# Altium project EASY-EAI-Nano-TB V1.01.PrjPcb (part 1 of 4)
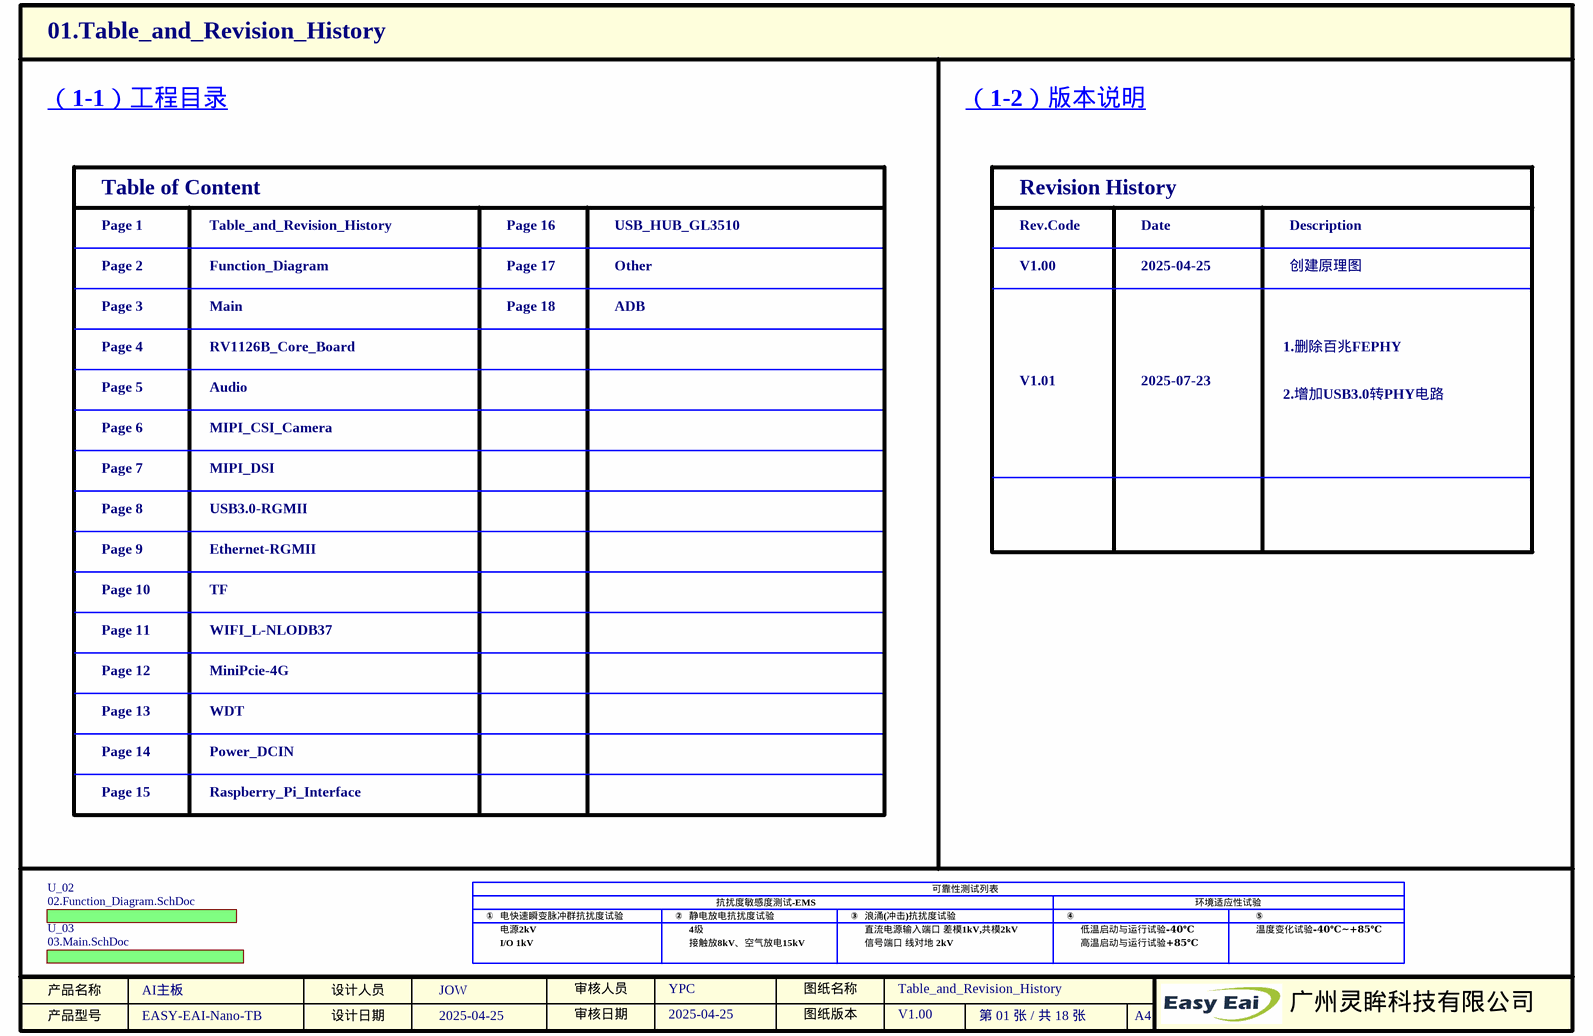
[diagram p0: 01.Table_Revision_History.SchDoc]
Designer: JOW; ProductModel: EASY-EAI-Nano-TB; ProductName: AI主板
18 sheets, 667 parts. Net scope: flat (ports and power ports of the same name join across sheets).
Board file: EASY-EAI-Nano-TB V1.01.PCBDOC
Sheets:
  01.Table_Revision_History.SchDoc
    U_02 = 02.Function_Diagram.SchDoc
    U_03 = 03.Main.SchDoc
      U_01 = 04.RV1126B_Core_Board.SchDoc
      U_14 = 14.Power_DCIN.SchDoc
      U_13 = 13.WDT.SchDoc
      U_17 = 17.Other.SchDoc
      U_05 = 05.Audio.SchDoc
      U_06 = 06.MIPI_CSI_Camera.SchDoc
      U_07 = 07.MIPI_DSI.SchDoc
      U_10 = 10.TF.SchDoc
      U_11 = 11.WIFI_L-NLODB37.SchDoc
      U_09 = 09.Ethernet-RGMII.SchDoc
      U_15 = 15.Raspberry_Pi_Interface.SchDoc
      U_08 = 08.USB3.0-RGMII.SchDoc
      U_16 = 16.USB_HUB_GL3510.SchDoc
      U_18 = 18.ADB.SchDoc
      U_12 = 12.MiniPcie-4G.SchDoc

## Sheet 01.Table_Revision_History.SchDoc
size A4; PageSetup: Record=PageOptions|CenterHorizontal=True|CenterVertical=True|PrintScale=1.00|XCorrection=1.00|YCorrection=1.00|PrintKind=0|BorderSize=5000000|LeftOffset=0|BottomOffset=0|Orientation=2|PaperLength=1000|PaperWidth=1000|Scale=100|PaperSource=7|PrintQuality=600|MediaType=1|DitherType=10|PaperKind=A4|PrintScaleMode=1; DesignDate: 2025-04-25; SheetName: Table_and_Revision_History; SheetVersion: Rev.A; SheetDescription: 工程目录及版本说明; CheckedBy: YPC; Organization: Altium Limited; Address1: L3, 12a Rodborough Rd; Address2: Frenchs Forest; Address3: NSW; Address4: Australia 2086; DocumentNumber: 1; Revision: V1.00; SheetNumber: 01; SheetTotal: 18; SheetDescribe: 工程目录及版本说明; Designer: JOW; CheckedData: 2025-04-25

### Sub-sheets
U_02 = 02.Function_Diagram.SchDoc: no entries
U_03 = 03.Main.SchDoc: no entries

### Notes on the sheet
- （1-1）工程目录
- （1-2）版本说明
- Table of Content
- Page 1
- Table_and_Revision_History
- Page 16
- USB_HUB_GL3510
- Revision History
- Rev.Code
- Date
- Description
- Page 2
- Page 3
- Function_Diagram
- Main
- Page 17
- Page 18
- Other
- ADB
- V1.00
- 2025-04-25
- 创建原理图
- Page 4
- RV1126B_Core_Board
- V1.01
- 2025-07-23
- 1.删除百兆FEPHY
- Page 5
- Page 6
- Audio
- MIPI_CSI_Camera
- 2.增加USB3.0转PHY电路
- Page 7
- Page 8
- MIPI_DSI
- USB3.0-RGMII
- Page 9
- Ethernet-RGMII
- Page 10
- Page 11
- TF
- WIFI_L-NLODB37
- Page 12
- Page 13
- MiniPcie-4G
- WDT
- Page 14
- Power_DCIN
- Page 15
- Raspberry_Pi_Interface
- ①
- 电快速瞬变脉冲群抗扰度试验
- ②
- 静电放电抗扰度试验
- 抗扰度敏感度测试-EMS
- ③
- 浪涌(冲击)抗扰度试验
- 可靠性测试列表
- ④
- 环境适应性试验
- ⑤
- 电源2kV
- I/O 1kV
- 4级
- 接触放8kV、空气放电15kV
- 直流电源输入端口 差模1kV,共模2kV
- 信号端口 线对地 2kV
- 低温启动与运行试验-40℃
- 高温启动与运行试验+85℃
- 温度变化试验-40℃~+85℃
- 产品名称
- 产品型号
- 设计人员
- 设计日期
- 审核人员
- 审核日期
- 图纸版本
- 图纸名称
- A4
- 广州灵眸科技有限公司

## Sheet 02.Function_Diagram.SchDoc
size A4; CheckedBy: YPC; DocumentNumber: 2; Revision: V1.00; SheetNumber: 02; SheetTotal: 18; SheetName: Function_Diagram; SheetDescribe: SheetDescribe; Designer: JOW; DesignDate: 2025-04-25; CheckedData: 2025-04-25; Rule: PcbType=ProtelPcb
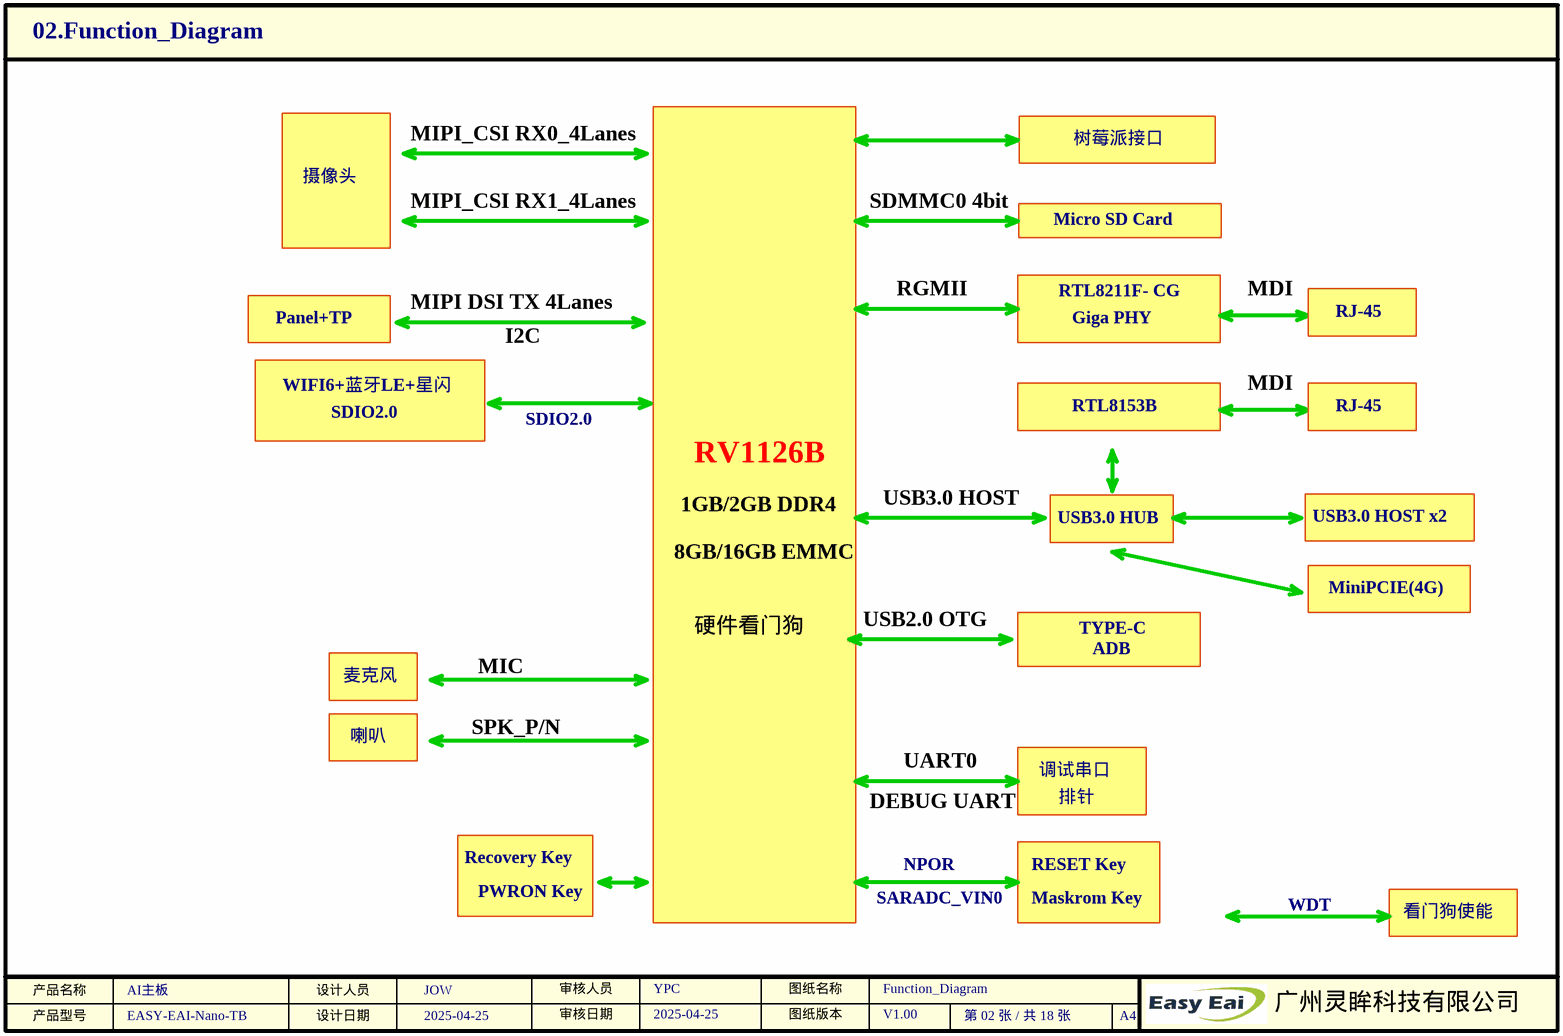
[diagram p1: 02.Function_Diagram.SchDoc]

### Notes on the sheet
- MIPI_CSI RX0_4Lanes
- 树莓派接口
- 摄像头
- MIPI_CSI RX1_4Lanes
- SDMMC0 4bit
- Micro SD Card
- MIPI DSI TX 4Lanes
- RGMII
- RTL8211F- CG
- MDI
- Panel+TP
- I2C
- Giga PHY
- RJ-45
- WIFI6+蓝牙LE+星闪
- SDIO2.0
- RTL8153B
- 1GB/2GB DDR4
- RV1126B
- USB3.0 HOST
- 8GB/16GB EMMC
- USB3.0 HUB
- USB3.0 HOST x2
- 硬件看门狗
- USB2.0 OTG
- TYPE-C
- ADB
- MiniPCIE(4G)
- 麦克风
- MIC
- 喇叭
- SPK_P/N
- UART0
- 调试串口
- DEBUG UART
- 排针
- Recovery Key
- PWRON Key
- SARADC_VIN0
- NPOR
- RESET Key
- Maskrom Key
- WDT
- 看门狗使能
- 产品名称
- 产品型号
- 设计人员
- 设计日期
- 审核人员
- 审核日期
- 图纸版本
- 图纸名称
- A4
- 广州灵眸科技有限公司

## Sheet 03.Main.SchDoc
size 566 x 398 mm; CheckedBy: YPC; DocumentNumber: 3; Revision: V1.00; SheetNumber: 03; SheetTotal: 18; SheetName: Main; SheetDescribe: Main; Designer: JOW; DesignDate: 2025-04-25; CheckedData: 2025-04-25; CheckDate: 2025-04-25
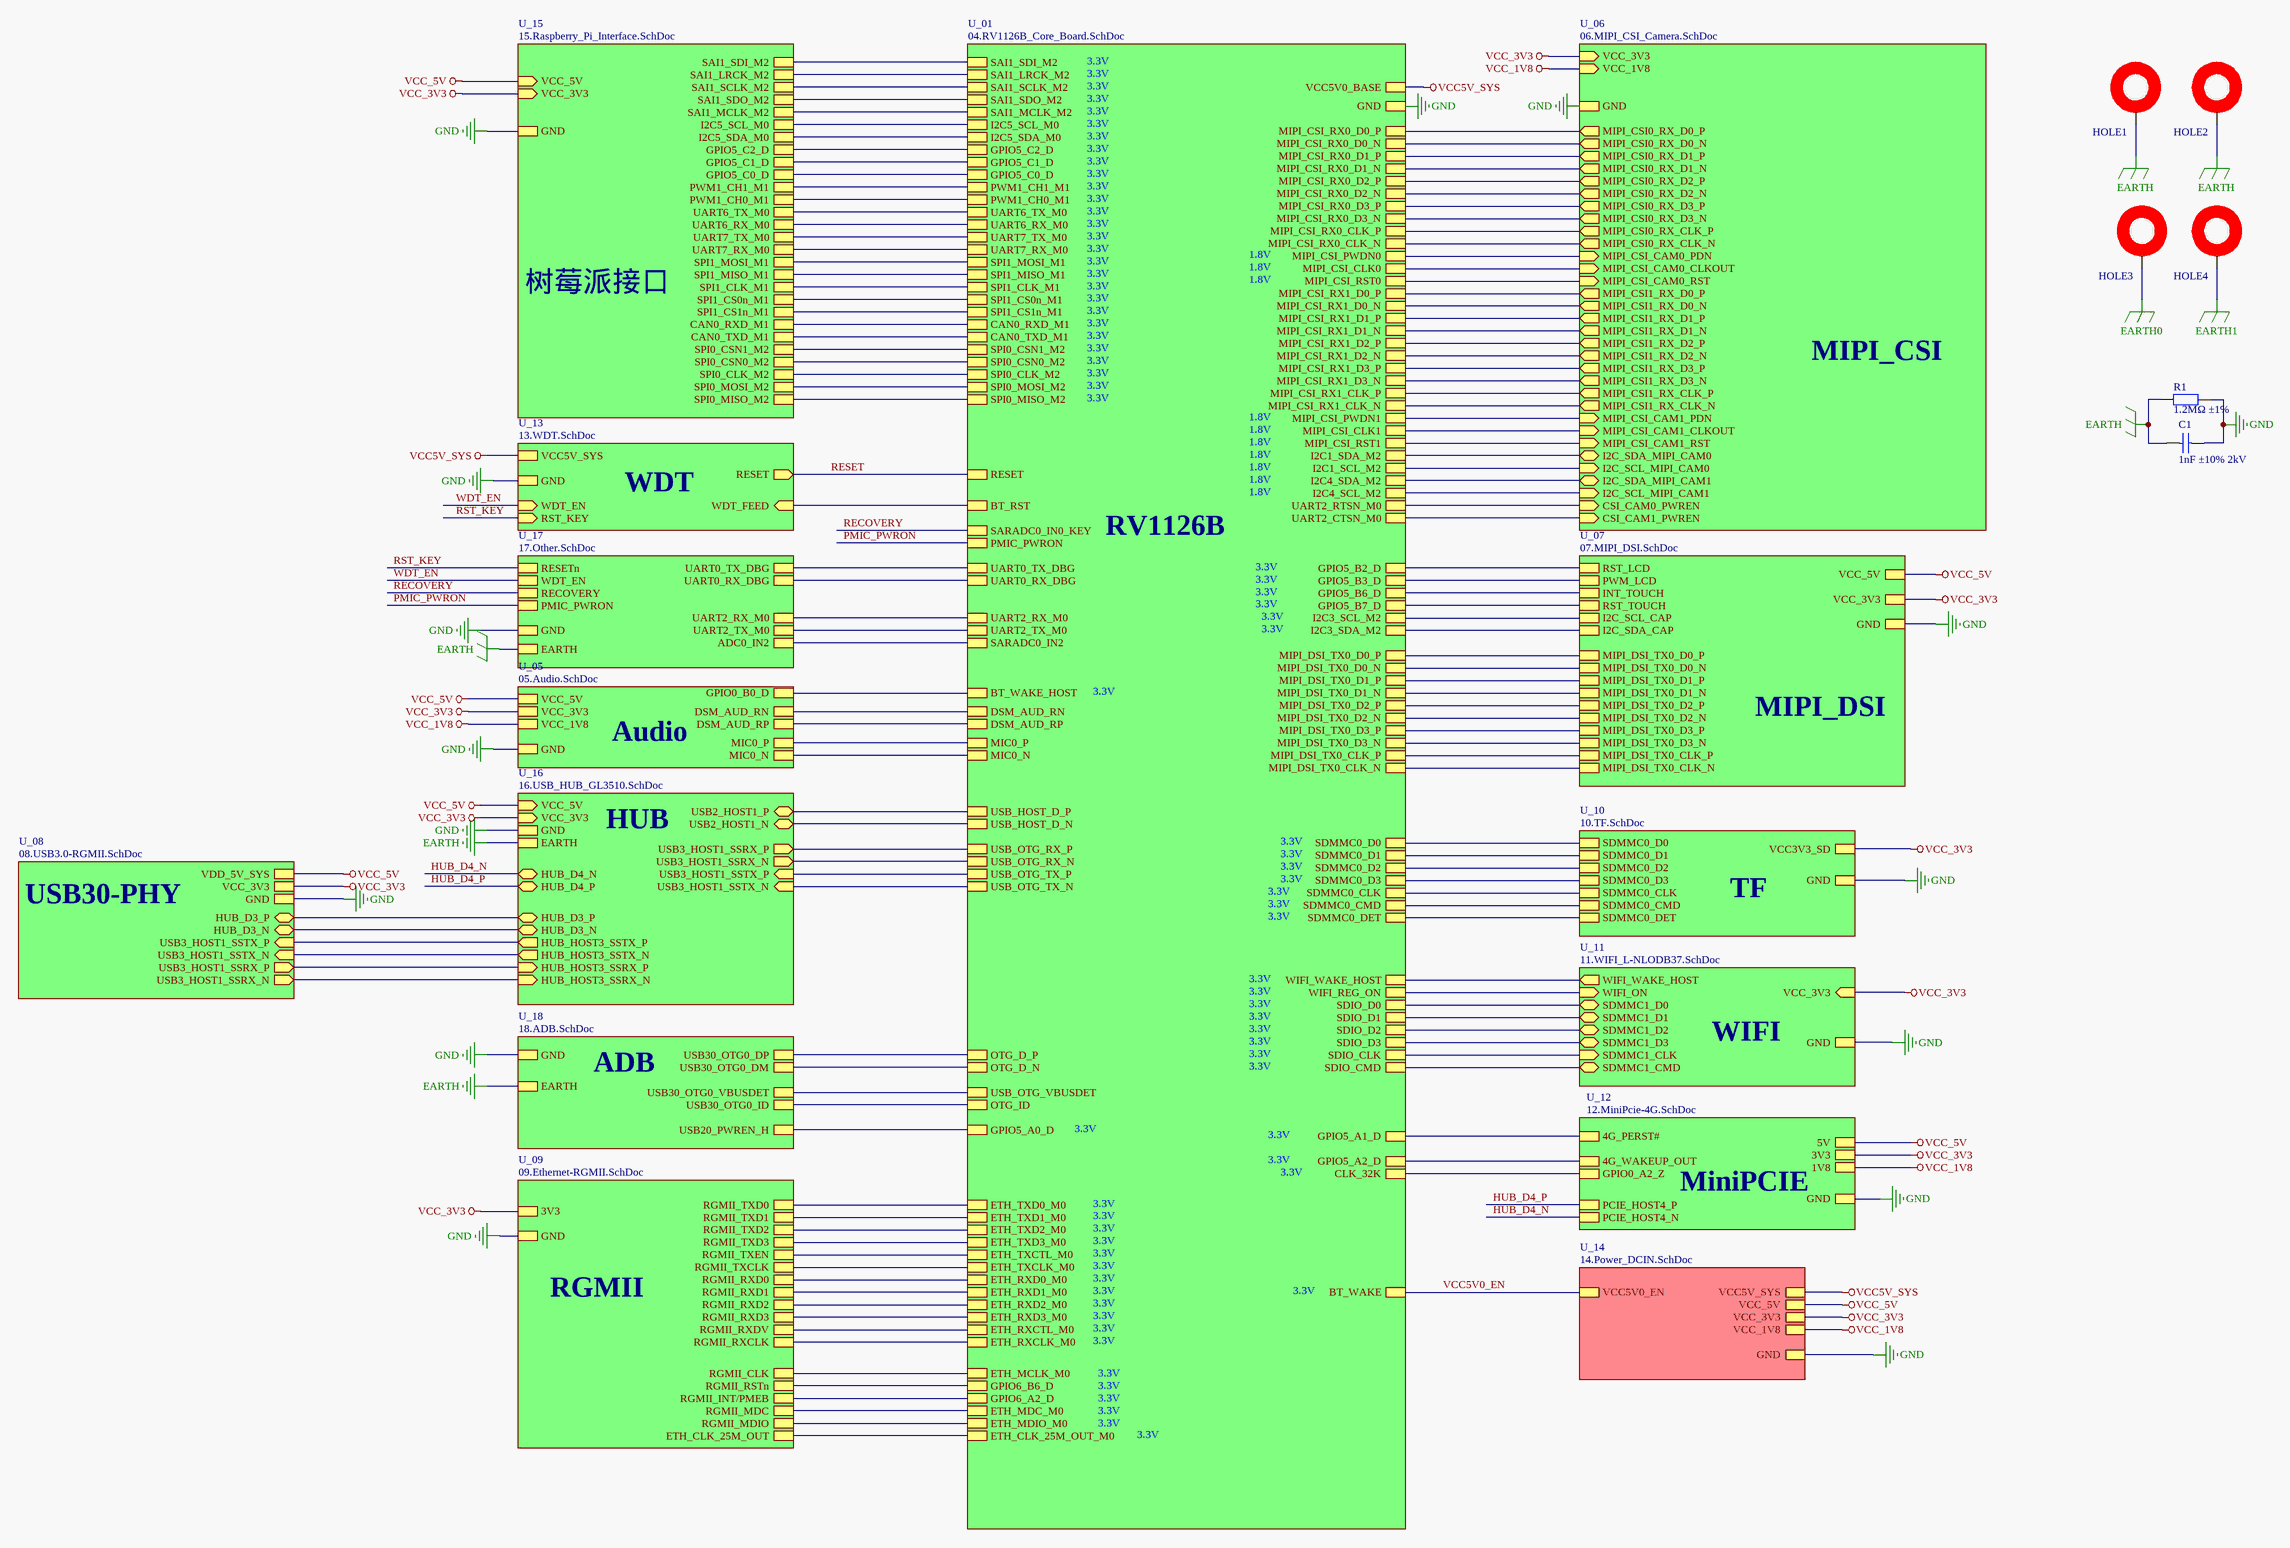
[diagram p2: 03.Main.SchDoc]

### Parts
C1  描述: 1nF ±10% 2kV  [1206_C]  (hidden comment: CC1206KKX7RDBB102)
HOLE1  HOLE1  [HOLE-3.2 - Screw]  (value not drawn)  (no BOM)
HOLE2  HOLE1  [HOLE-3.2 - Screw]  (value not drawn)  (no BOM)
HOLE3  HOLE1  [HOLE-3.2 - Screw]  (value not drawn)  (no BOM)
HOLE4  HOLE1  [HOLE-3.2 - Screw]  (value not drawn)  (no BOM)
R1  描述: 1.2MΩ ±1%  [1206_R]  (hidden comment: 1206W4F1204T5E)

### Sub-sheets
U_01 = 04.RV1126B_Core_Board.SchDoc: VCC5V0_BASE, GND, MIPI_CSI_RX1_D0_P, MIPI_CSI_RX1_D0_N, MIPI_CSI_RX1_D1_P, MIPI_CSI_RX1_D1_N, MIPI_CSI_RX1_D2_P, MIPI_CSI_RX1_D2_N, MIPI_CSI_RX1_D3_P, MIPI_CSI_RX1_D3_N, MIPI_CSI_RX1_CLK_P, MIPI_CSI_RX1_CLK_N, MIPI_CSI_PWDN1, MIPI_CSI_CLK1, MIPI_CSI_RST1, MIPI_CSI_RX0_D0_P, MIPI_CSI_RX0_D0_N, MIPI_CSI_RX0_D1_P, MIPI_CSI_RX0_D1_N, MIPI_CSI_RX0_D2_P, MIPI_CSI_RX0_D2_N, MIPI_CSI_RX0_D3_P, MIPI_CSI_RX0_D3_N, MIPI_CSI_RX0_CLK_P, MIPI_CSI_RX0_CLK_N, MIPI_CSI_PWDN0, MIPI_CSI_CLK0, MIPI_CSI_RST0, OTG_ID, OTG_D_N, OTG_D_P, USB_HOST_D_N, USB_HOST_D_P, MIPI_DSI_TX0_D0_P, MIPI_DSI_TX0_D0_N, MIPI_DSI_TX0_D1_P, MIPI_DSI_TX0_D1_N, MIPI_DSI_TX0_D2_P, MIPI_DSI_TX0_D2_N, MIPI_DSI_TX0_D3_P, MIPI_DSI_TX0_D3_N, MIPI_DSI_TX0_CLK_P, MIPI_DSI_TX0_CLK_N, SDMMC0_CMD, SDMMC0_D0, SDMMC0_D1, SDMMC0_D2, SDMMC0_D3, SDMMC0_CLK, CLK_32K, BT_WAKE, SDIO_CLK, SDIO_D0, SDIO_D1, SDIO_D2, SDIO_D3, SDIO_CMD, RESET, SDMMC0_DET, WIFI_REG_ON, BT_RST, WIFI_WAKE_HOST, SPI0_MOSI_M2, SPI0_CLK_M2, UART7_TX_M0, SPI0_CSN0_M2, UART6_RX_M0, UART6_TX_M0, GPIO5_B3_D, GPIO5_B2_D, GPIO5_A1_D, GPIO5_A0_D, SPI0_CSN1_M2, GPIO5_A2_D, DSM_AUD_RP, MIC0_P, MIC0_N, USB_OTG_VBUSDET, GPIO5_C2_D, SPI0_MISO_M2, I2C3_SCL_M2, I2C3_SDA_M2, PWM1_CH1_M1, PWM1_CH0_M1, SAI1_SDI_M2, SAI1_LRCK_M2, SAI1_SCLK_M2, SAI1_SDO_M2, SAI1_MCLK_M2, GPIO5_C1_D, GPIO5_C0_D, UART7_RX_M0, GPIO5_B6_D, GPIO5_B7_D, ETH_RXCLK_M0, ETH_MCLK_M0, ETH_TXCTL_M0, ETH_RXD0_M0, ETH_TXD1_M0, ETH_TXD0_M0, ETH_TXD3_M0, ETH_RXD2_M0, ETH_TXD2_M0, ETH_RXD1_M0, ETH_RXD3_M0, GPIO6_A2_D, CAN0_TXD_M1, ETH_RXCTL_M0, GPIO6_B6_D, ETH_MDIO_M0, ETH_CLK_25M_OUT_M0, ETH_MDC_M0, ETH_TXCLK_M0, CAN0_RXD_M1, UART0_RX_DBG, UART0_TX_DBG, UART2_RX_M0, UART2_TX_M0, UART2_RTSN_M0, UART2_CTSN_M0, SARADC0_IN2, SARADC0_IN0_KEY, PMIC_PWRON, USB_OTG_TX_P, USB_OTG_TX_N, USB_OTG_RX_P, USB_OTG_RX_N, I2C1_SDA_M2, I2C1_SCL_M2, I2C5_SDA_M0, I2C4_SDA_M2, I2C4_SCL_M2, I2C5_SCL_M0, SPI1_MOSI_M1, SPI1_MISO_M1, SPI1_CS1n_M1, SPI1_CLK_M1, SPI1_CS0n_M1, DSM_AUD_RN, BT_WAKE_HOST
U_05 = 05.Audio.SchDoc: GND, DSM_AUD_RN, DSM_AUD_RP, MIC0_P, MIC0_N, VCC_1V8, VCC_5V, GPIO0_B0_D, VCC_3V3
U_06 = 06.MIPI_CSI_Camera.SchDoc: MIPI_CSI1_RX_CLK_N (out), MIPI_CSI1_RX_CLK_P (out), MIPI_CSI1_RX_D0_N (out), MIPI_CSI1_RX_D0_P (out), MIPI_CSI1_RX_D1_N (out), MIPI_CSI1_RX_D1_P (out), MIPI_CSI1_RX_D2_N (out), MIPI_CSI1_RX_D2_P (out), MIPI_CSI1_RX_D3_N (out), MIPI_CSI1_RX_D3_P (out), MIPI_CSI0_RX_D2_N (out), MIPI_CSI0_RX_D3_N (out), MIPI_CSI0_RX_D2_P (out), MIPI_CSI0_RX_D3_P (out), MIPI_CSI0_RX_D1_N (out), MIPI_CSI0_RX_D1_P (out), MIPI_CSI0_RX_CLK_N (out), MIPI_CSI0_RX_CLK_P (out), MIPI_CSI0_RX_D0_N (out), MIPI_CSI0_RX_D0_P (out), I2C_SDA_MIPI_CAM0 (bidir), I2C_SCL_MIPI_CAM0 (in), I2C_SDA_MIPI_CAM1 (bidir), I2C_SCL_MIPI_CAM1 (in), GND, VCC_3V3 (in), VCC_1V8 (in), MIPI_CSI_CAM0_RST (in), MIPI_CSI_CAM0_PDN (in), MIPI_CSI_CAM0_CLKOUT (in), MIPI_CSI_CAM1_RST (in), MIPI_CSI_CAM1_PDN (in), MIPI_CSI_CAM1_CLKOUT (in), CSI_CAM1_PWREN (in), CSI_CAM0_PWREN (in)
U_07 = 07.MIPI_DSI.SchDoc: GND, RST_LCD, PWM_LCD, I2C_SDA_CAP, I2C_SCL_CAP, INT_TOUCH, RST_TOUCH, VCC_3V3, MIPI_DSI_TX0_D0_P, MIPI_DSI_TX0_D0_N, MIPI_DSI_TX0_D1_P, MIPI_DSI_TX0_D1_N, MIPI_DSI_TX0_D2_P, MIPI_DSI_TX0_D2_N, MIPI_DSI_TX0_D3_P, MIPI_DSI_TX0_D3_N, MIPI_DSI_TX0_CLK_P, MIPI_DSI_TX0_CLK_N, VCC_5V
U_08 = 08.USB3.0-RGMII.SchDoc: USB3_HOST1_SSRX_N (out), USB3_HOST1_SSTX_P (in), USB3_HOST1_SSTX_N (in), GND, VDD_5V_SYS, HUB_D3_N (bidir), USB3_HOST1_SSRX_P (out), HUB_D3_P (bidir), VCC_3V3
U_09 = 09.Ethernet-RGMII.SchDoc: GND, 3V3, RGMII_TXD0, RGMII_TXD1, RGMII_TXD2, RGMII_TXD3, RGMII_TXEN, RGMII_TXCLK, RGMII_RXD0, RGMII_RXD1, RGMII_RXD2, RGMII_RXD3, RGMII_RXDV, RGMII_RXCLK, ETH_CLK_25M_OUT, RGMII_CLK, RGMII_MDC, RGMII_MDIO, RGMII_RSTn, RGMII_INT/PMEB
U_10 = 10.TF.SchDoc: SDMMC0_D0, SDMMC0_D1, SDMMC0_D2, SDMMC0_D3, SDMMC0_CLK, SDMMC0_CMD, SDMMC0_DET, VCC3V3_SD, GND
U_11 = 11.WIFI_L-NLODB37.SchDoc: GND, VCC_3V3 (in), SDMMC1_D3 (bidir), SDMMC1_D2 (bidir), SDMMC1_D1 (bidir), SDMMC1_D0 (bidir), SDMMC1_CMD (bidir), SDMMC1_CLK (in), WIFI_ON (in), WIFI_WAKE_HOST (out)
U_12 = 12.MiniPcie-4G.SchDoc: GND, 5V, 3V3, 4G_PERST#, 4G_WAKEUP_OUT, 1V8, PCIE_HOST4_P, PCIE_HOST4_N, GPIO0_A2_Z
U_13 = 13.WDT.SchDoc: WDT_FEED (in), WDT_EN (in), RESET (out), RST_KEY (in), GND, VCC5V_SYS
U_14 = 14.Power_DCIN.SchDoc: GND, VCC_3V3, VCC_1V8, VCC_5V, VCC5V0_EN, VCC5V_SYS
U_15 = 15.Raspberry_Pi_Interface.SchDoc: VCC_5V (in), VCC_3V3 (in), GND, SAI1_SDI_M2, SAI1_LRCK_M2, SAI1_SCLK_M2, SAI1_SDO_M2, SAI1_MCLK_M2, SPI1_CS1n_M1, SPI1_CS0n_M1, SPI1_CLK_M1, SPI1_MISO_M1, SPI1_MOSI_M1, PWM1_CH1_M1, PWM1_CH0_M1, GPIO5_C2_D, GPIO5_C1_D, GPIO5_C0_D, SPI0_CSN1_M2, SPI0_CSN0_M2, SPI0_CLK_M2, SPI0_MOSI_M2, I2C5_SCL_M0, I2C5_SDA_M0, SPI0_MISO_M2, UART6_TX_M0, UART6_RX_M0, UART7_TX_M0, UART7_RX_M0, CAN0_RXD_M1, CAN0_TXD_M1
U_16 = 16.USB_HUB_GL3510.SchDoc: GND, VCC_5V (in), VCC_3V3 (in), USB2_HOST1_P (bidir), USB2_HOST1_N (bidir), USB3_HOST1_SSRX_P (out), USB3_HOST1_SSRX_N (out), USB3_HOST1_SSTX_P (in), USB3_HOST1_SSTX_N (in), EARTH, HUB_D4_P (bidir), HUB_D4_N (bidir), HUB_HOST3_SSRX_N (in), HUB_HOST3_SSRX_P (in), HUB_D3_N (bidir), HUB_HOST3_SSTX_N (out), HUB_HOST3_SSTX_P (out), HUB_D3_P (bidir)
U_17 = 17.Other.SchDoc: RESETn, PMIC_PWRON, RECOVERY, UART0_RX_DBG, UART0_TX_DBG, WDT_EN, UART2_RX_M0, UART2_TX_M0, ADC0_IN2, GND, EARTH
U_18 = 18.ADB.SchDoc: GND, EARTH, USB30_OTG0_VBUSDET, USB30_OTG0_DP, USB30_OTG0_DM, USB30_OTG0_ID, USB20_PWREN_H

### Nets
EARTH: C1.1 HOLE1.1 HOLE2.1 R1.1 ; sheet U_17/EARTH, sheet U_16/EARTH, sheet U_18/EARTH
EARTH0: HOLE3.1
EARTH1: HOLE4.1
GND: C1.2 R1.2 ; sheet U_01/GND, sheet U_14/GND, sheet U_13/GND, sheet U_17/GND, sheet U_05/GND, sheet U_06/GND, sheet U_07/GND, sheet U_10/GND, sheet U_11/GND, sheet U_09/GND, sheet U_15/GND, sheet U_08/GND, sheet U_16/GND, sheet U_18/GND, sheet U_12/GND  [project net CHIP_GND]
VCC5V_SYS: sheet U_01/VCC5V0_BASE, sheet U_14/VCC5V_SYS, sheet U_13/VCC5V_SYS
VCC_1V8: sheet U_14/VCC_1V8, sheet U_05/VCC_1V8, sheet U_06/VCC_1V8, sheet U_12/1V8
VCC_3V3: sheet U_14/VCC_3V3, sheet U_05/VCC_3V3, sheet U_06/VCC_3V3, sheet U_07/VCC_3V3, sheet U_10/VCC3V3_SD, sheet U_11/VCC_3V3, sheet U_09/3V3, sheet U_15/VCC_3V3, sheet U_08/VCC_3V3, sheet U_16/VCC_3V3, sheet U_12/3V3  [project net VCC3V3]
VCC_5V: sheet U_14/VCC_5V, sheet U_05/VCC_5V, sheet U_07/VCC_5V, sheet U_15/VCC_5V, sheet U_08/VDD_5V_SYS, sheet U_16/VCC_5V, sheet U_12/5V
HUB_D4_N: sheet U_16/HUB_D4_N, sheet U_12/PCIE_HOST4_N
HUB_D4_P: sheet U_16/HUB_D4_P, sheet U_12/PCIE_HOST4_P
PMIC_PWRON: sheet U_01/PMIC_PWRON, sheet U_17/PMIC_PWRON
RECOVERY: sheet U_01/SARADC0_IN0_KEY, sheet U_17/RECOVERY
RESET: sheet U_01/RESET, sheet U_13/RESET
RST_KEY: sheet U_13/RST_KEY, sheet U_17/RESETn
VCC5V0_EN: sheet U_01/BT_WAKE, sheet U_14/VCC5V0_EN
WDT_EN: sheet U_13/WDT_EN, sheet U_17/WDT_EN
(unnamed): sheet U_01/MIPI_CSI_RX1_D0_P, sheet U_06/MIPI_CSI1_RX_D0_P
(unnamed): sheet U_01/MIPI_CSI_RX1_D0_N, sheet U_06/MIPI_CSI1_RX_D0_N
(unnamed): sheet U_01/MIPI_CSI_RX1_D1_P, sheet U_06/MIPI_CSI1_RX_D1_P
(unnamed): sheet U_01/MIPI_CSI_RX1_D1_N, sheet U_06/MIPI_CSI1_RX_D1_N
(unnamed): sheet U_01/MIPI_CSI_RX1_D2_P, sheet U_06/MIPI_CSI1_RX_D2_P
(unnamed): sheet U_01/MIPI_CSI_RX1_D2_N, sheet U_06/MIPI_CSI1_RX_D2_N
(unnamed): sheet U_01/MIPI_CSI_RX1_D3_P, sheet U_06/MIPI_CSI1_RX_D3_P
(unnamed): sheet U_01/MIPI_CSI_RX1_D3_N, sheet U_06/MIPI_CSI1_RX_D3_N
(unnamed): sheet U_01/MIPI_CSI_RX1_CLK_P, sheet U_06/MIPI_CSI1_RX_CLK_P
(unnamed): sheet U_01/MIPI_CSI_RX1_CLK_N, sheet U_06/MIPI_CSI1_RX_CLK_N
(unnamed): sheet U_01/MIPI_CSI_PWDN1, sheet U_06/MIPI_CSI_CAM1_PDN
(unnamed): sheet U_01/MIPI_CSI_CLK1, sheet U_06/MIPI_CSI_CAM1_CLKOUT
(unnamed): sheet U_01/MIPI_CSI_RST1, sheet U_06/MIPI_CSI_CAM1_RST
(unnamed): sheet U_01/MIPI_CSI_RX0_D0_P, sheet U_06/MIPI_CSI0_RX_D0_P
(unnamed): sheet U_01/MIPI_CSI_RX0_D0_N, sheet U_06/MIPI_CSI0_RX_D0_N
(unnamed): sheet U_01/MIPI_CSI_RX0_D1_P, sheet U_06/MIPI_CSI0_RX_D1_P
(unnamed): sheet U_01/MIPI_CSI_RX0_D1_N, sheet U_06/MIPI_CSI0_RX_D1_N
(unnamed): sheet U_01/MIPI_CSI_RX0_D2_P, sheet U_06/MIPI_CSI0_RX_D2_P
(unnamed): sheet U_01/MIPI_CSI_RX0_D2_N, sheet U_06/MIPI_CSI0_RX_D2_N
(unnamed): sheet U_01/MIPI_CSI_RX0_D3_P, sheet U_06/MIPI_CSI0_RX_D3_P
(unnamed): sheet U_01/MIPI_CSI_RX0_D3_N, sheet U_06/MIPI_CSI0_RX_D3_N
(unnamed): sheet U_01/MIPI_CSI_RX0_CLK_P, sheet U_06/MIPI_CSI0_RX_CLK_P
(unnamed): sheet U_01/MIPI_CSI_RX0_CLK_N, sheet U_06/MIPI_CSI0_RX_CLK_N
(unnamed): sheet U_01/MIPI_CSI_PWDN0, sheet U_06/MIPI_CSI_CAM0_PDN
(unnamed): sheet U_01/MIPI_CSI_CLK0, sheet U_06/MIPI_CSI_CAM0_CLKOUT
(unnamed): sheet U_01/MIPI_CSI_RST0, sheet U_06/MIPI_CSI_CAM0_RST
(unnamed): sheet U_01/OTG_ID, sheet U_18/USB30_OTG0_ID
(unnamed): sheet U_01/OTG_D_N, sheet U_18/USB30_OTG0_DM
(unnamed): sheet U_01/OTG_D_P, sheet U_18/USB30_OTG0_DP
(unnamed): sheet U_01/USB_HOST_D_N, sheet U_16/USB2_HOST1_N
(unnamed): sheet U_01/USB_HOST_D_P, sheet U_16/USB2_HOST1_P
(unnamed): sheet U_01/MIPI_DSI_TX0_D0_P, sheet U_07/MIPI_DSI_TX0_D0_P
(unnamed): sheet U_01/MIPI_DSI_TX0_D0_N, sheet U_07/MIPI_DSI_TX0_D0_N
(unnamed): sheet U_01/MIPI_DSI_TX0_D1_P, sheet U_07/MIPI_DSI_TX0_D1_P
(unnamed): sheet U_01/MIPI_DSI_TX0_D1_N, sheet U_07/MIPI_DSI_TX0_D1_N
(unnamed): sheet U_01/MIPI_DSI_TX0_D2_P, sheet U_07/MIPI_DSI_TX0_D2_P
(unnamed): sheet U_01/MIPI_DSI_TX0_D2_N, sheet U_07/MIPI_DSI_TX0_D2_N
(unnamed): sheet U_01/MIPI_DSI_TX0_D3_P, sheet U_07/MIPI_DSI_TX0_D3_P
(unnamed): sheet U_01/MIPI_DSI_TX0_D3_N, sheet U_07/MIPI_DSI_TX0_D3_N
(unnamed): sheet U_01/MIPI_DSI_TX0_CLK_P, sheet U_07/MIPI_DSI_TX0_CLK_P
(unnamed): sheet U_01/MIPI_DSI_TX0_CLK_N, sheet U_07/MIPI_DSI_TX0_CLK_N
(unnamed): sheet U_01/SDMMC0_CMD, sheet U_10/SDMMC0_CMD
(unnamed): sheet U_01/SDMMC0_D0, sheet U_10/SDMMC0_D0
(unnamed): sheet U_01/SDMMC0_D1, sheet U_10/SDMMC0_D1
(unnamed): sheet U_01/SDMMC0_D2, sheet U_10/SDMMC0_D2
(unnamed): sheet U_01/SDMMC0_D3, sheet U_10/SDMMC0_D3
(unnamed): sheet U_01/SDMMC0_CLK, sheet U_10/SDMMC0_CLK
(unnamed): sheet U_01/CLK_32K, sheet U_12/GPIO0_A2_Z
(unnamed): sheet U_01/SDIO_CLK, sheet U_11/SDMMC1_CLK
(unnamed): sheet U_01/SDIO_D0, sheet U_11/SDMMC1_D0
(unnamed): sheet U_01/SDIO_D1, sheet U_11/SDMMC1_D1
(unnamed): sheet U_01/SDIO_D2, sheet U_11/SDMMC1_D2
(unnamed): sheet U_01/SDIO_D3, sheet U_11/SDMMC1_D3
(unnamed): sheet U_01/SDIO_CMD, sheet U_11/SDMMC1_CMD
(unnamed): sheet U_01/SDMMC0_DET, sheet U_10/SDMMC0_DET
(unnamed): sheet U_01/WIFI_REG_ON, sheet U_11/WIFI_ON
(unnamed): sheet U_01/BT_RST, sheet U_13/WDT_FEED
(unnamed): sheet U_01/WIFI_WAKE_HOST, sheet U_11/WIFI_WAKE_HOST
(unnamed): sheet U_01/SPI0_MOSI_M2, sheet U_15/SPI0_MOSI_M2
(unnamed): sheet U_01/SPI0_CLK_M2, sheet U_15/SPI0_CLK_M2
(unnamed): sheet U_01/UART7_TX_M0, sheet U_15/UART7_TX_M0
(unnamed): sheet U_01/SPI0_CSN0_M2, sheet U_15/SPI0_CSN0_M2
(unnamed): sheet U_01/UART6_RX_M0, sheet U_15/UART6_RX_M0
(unnamed): sheet U_01/UART6_TX_M0, sheet U_15/UART6_TX_M0
(unnamed): sheet U_01/GPIO5_B3_D, sheet U_07/PWM_LCD
(unnamed): sheet U_01/GPIO5_B2_D, sheet U_07/RST_LCD
(unnamed): sheet U_01/GPIO5_A1_D, sheet U_12/4G_PERST#
(unnamed): sheet U_01/GPIO5_A0_D, sheet U_18/USB20_PWREN_H
(unnamed): sheet U_01/SPI0_CSN1_M2, sheet U_15/SPI0_CSN1_M2
(unnamed): sheet U_01/GPIO5_A2_D, sheet U_12/4G_WAKEUP_OUT
(unnamed): sheet U_01/DSM_AUD_RP, sheet U_05/DSM_AUD_RP
(unnamed): sheet U_01/MIC0_P, sheet U_05/MIC0_P
(unnamed): sheet U_01/MIC0_N, sheet U_05/MIC0_N
(unnamed): sheet U_01/USB_OTG_VBUSDET, sheet U_18/USB30_OTG0_VBUSDET
(unnamed): sheet U_01/GPIO5_C2_D, sheet U_15/GPIO5_C2_D
(unnamed): sheet U_01/SPI0_MISO_M2, sheet U_15/SPI0_MISO_M2
(unnamed): sheet U_01/I2C3_SCL_M2, sheet U_07/I2C_SCL_CAP
(unnamed): sheet U_01/I2C3_SDA_M2, sheet U_07/I2C_SDA_CAP
(unnamed): sheet U_01/PWM1_CH1_M1, sheet U_15/PWM1_CH1_M1
(unnamed): sheet U_01/PWM1_CH0_M1, sheet U_15/PWM1_CH0_M1
(unnamed): sheet U_01/SAI1_SDI_M2, sheet U_15/SAI1_SDI_M2
(unnamed): sheet U_01/SAI1_LRCK_M2, sheet U_15/SAI1_LRCK_M2
(unnamed): sheet U_01/SAI1_SCLK_M2, sheet U_15/SAI1_SCLK_M2
(unnamed): sheet U_01/SAI1_SDO_M2, sheet U_15/SAI1_SDO_M2
(unnamed): sheet U_01/SAI1_MCLK_M2, sheet U_15/SAI1_MCLK_M2
(unnamed): sheet U_01/GPIO5_C1_D, sheet U_15/GPIO5_C1_D
(unnamed): sheet U_01/GPIO5_C0_D, sheet U_15/GPIO5_C0_D
(unnamed): sheet U_01/UART7_RX_M0, sheet U_15/UART7_RX_M0
(unnamed): sheet U_01/GPIO5_B6_D, sheet U_07/INT_TOUCH
(unnamed): sheet U_01/GPIO5_B7_D, sheet U_07/RST_TOUCH
(unnamed): sheet U_01/ETH_RXCLK_M0, sheet U_09/RGMII_RXCLK
(unnamed): sheet U_01/ETH_MCLK_M0, sheet U_09/RGMII_CLK
(unnamed): sheet U_01/ETH_TXCTL_M0, sheet U_09/RGMII_TXEN
(unnamed): sheet U_01/ETH_RXD0_M0, sheet U_09/RGMII_RXD0
(unnamed): sheet U_01/ETH_TXD1_M0, sheet U_09/RGMII_TXD1
(unnamed): sheet U_01/ETH_TXD0_M0, sheet U_09/RGMII_TXD0
(unnamed): sheet U_01/ETH_TXD3_M0, sheet U_09/RGMII_TXD3
(unnamed): sheet U_01/ETH_RXD2_M0, sheet U_09/RGMII_RXD2
(unnamed): sheet U_01/ETH_TXD2_M0, sheet U_09/RGMII_TXD2
(unnamed): sheet U_01/ETH_RXD1_M0, sheet U_09/RGMII_RXD1
(unnamed): sheet U_01/ETH_RXD3_M0, sheet U_09/RGMII_RXD3
(unnamed): sheet U_01/GPIO6_A2_D, sheet U_09/RGMII_INT/PMEB
(unnamed): sheet U_01/CAN0_TXD_M1, sheet U_15/CAN0_TXD_M1
(unnamed): sheet U_01/ETH_RXCTL_M0, sheet U_09/RGMII_RXDV
(unnamed): sheet U_01/GPIO6_B6_D, sheet U_09/RGMII_RSTn
(unnamed): sheet U_01/ETH_MDIO_M0, sheet U_09/RGMII_MDIO
(unnamed): sheet U_01/ETH_CLK_25M_OUT_M0, sheet U_09/ETH_CLK_25M_OUT
(unnamed): sheet U_01/ETH_MDC_M0, sheet U_09/RGMII_MDC
(unnamed): sheet U_01/ETH_TXCLK_M0, sheet U_09/RGMII_TXCLK
(unnamed): sheet U_01/CAN0_RXD_M1, sheet U_15/CAN0_RXD_M1
(unnamed): sheet U_01/UART0_RX_DBG, sheet U_17/UART0_RX_DBG
(unnamed): sheet U_01/UART0_TX_DBG, sheet U_17/UART0_TX_DBG
(unnamed): sheet U_01/UART2_RX_M0, sheet U_17/UART2_RX_M0
(unnamed): sheet U_01/UART2_TX_M0, sheet U_17/UART2_TX_M0
(unnamed): sheet U_01/UART2_RTSN_M0, sheet U_06/CSI_CAM0_PWREN
(unnamed): sheet U_01/UART2_CTSN_M0, sheet U_06/CSI_CAM1_PWREN
(unnamed): sheet U_01/SARADC0_IN2, sheet U_17/ADC0_IN2
(unnamed): sheet U_01/USB_OTG_TX_P, sheet U_16/USB3_HOST1_SSTX_P
(unnamed): sheet U_01/USB_OTG_TX_N, sheet U_16/USB3_HOST1_SSTX_N
(unnamed): sheet U_01/USB_OTG_RX_P, sheet U_16/USB3_HOST1_SSRX_P
(unnamed): sheet U_01/USB_OTG_RX_N, sheet U_16/USB3_HOST1_SSRX_N
(unnamed): sheet U_01/I2C1_SDA_M2, sheet U_06/I2C_SDA_MIPI_CAM0
(unnamed): sheet U_01/I2C1_SCL_M2, sheet U_06/I2C_SCL_MIPI_CAM0
(unnamed): sheet U_01/I2C5_SDA_M0, sheet U_15/I2C5_SDA_M0
(unnamed): sheet U_01/I2C4_SDA_M2, sheet U_06/I2C_SDA_MIPI_CAM1
(unnamed): sheet U_01/I2C4_SCL_M2, sheet U_06/I2C_SCL_MIPI_CAM1
(unnamed): sheet U_01/I2C5_SCL_M0, sheet U_15/I2C5_SCL_M0
(unnamed): sheet U_01/SPI1_MOSI_M1, sheet U_15/SPI1_MOSI_M1
(unnamed): sheet U_01/SPI1_MISO_M1, sheet U_15/SPI1_MISO_M1
(unnamed): sheet U_01/SPI1_CS1n_M1, sheet U_15/SPI1_CS1n_M1
(unnamed): sheet U_01/SPI1_CLK_M1, sheet U_15/SPI1_CLK_M1
(unnamed): sheet U_01/SPI1_CS0n_M1, sheet U_15/SPI1_CS0n_M1
(unnamed): sheet U_01/DSM_AUD_RN, sheet U_05/DSM_AUD_RN
(unnamed): sheet U_01/BT_WAKE_HOST, sheet U_05/GPIO0_B0_D
(unnamed): sheet U_08/USB3_HOST1_SSRX_N, sheet U_16/HUB_HOST3_SSRX_N
(unnamed): sheet U_08/USB3_HOST1_SSTX_P, sheet U_16/HUB_HOST3_SSTX_P
(unnamed): sheet U_08/USB3_HOST1_SSTX_N, sheet U_16/HUB_HOST3_SSTX_N
(unnamed): sheet U_08/HUB_D3_N, sheet U_16/HUB_D3_N
(unnamed): sheet U_08/USB3_HOST1_SSRX_P, sheet U_16/HUB_HOST3_SSRX_P
(unnamed): sheet U_08/HUB_D3_P, sheet U_16/HUB_D3_P

### Notes on the sheet
- 3.3V
- 树莓派接口
- 1.8V
- MIPI_CSI
- WDT
- RV1126B
- MIPI_DSI
- Audio
- HUB
- USB30-PHY
- TF
- WIFI
- ADB
- MiniPCIE
- RGMII
- 产品名称
- 产品型号
- 设计人员
- 设计日期
- 审核人员
- 审核日期
- 图纸描述
- 图纸名称
- 图纸版本
- A2
- 广州灵眸科技有限公司

### Library data of the parts
C1 = 1206 1nF ±10% 2kV: SPZL000332; 名称: 贴片电容; 厂商: YAGEO(国巨); 封装: 1206; 工作温度: -55~125℃; 贴片和直插: SMD; 型号: CC1206KKX7RDBB102; SuppliersPartNumber: C23631; 商品编号: SPZL000332
R1 = 1206 1.2MΩ ±1%: SPZL000388; 封装: 1206; 厂商: UNI-ROYAL(厚声); 名称: 电阻; 贴片和直插: SMD; 工作温度: -55~155℃; SuppliersPartNumber: C22107; 型号: 1206W4F1204T5E; 商品编号: SPZL000388

## Sheet 04.RV1126B_Core_Board.SchDoc
size A3; CheckedBy: YPC; DocumentNumber: 4; Revision: V1.00; SheetNumber: 04; SheetTotal: 18; SheetName: SheetName; SheetDescribe: SheetDescribe; Designer: JOW; DesignDate: 2025-04-25; CheckedData: 2025-04-25
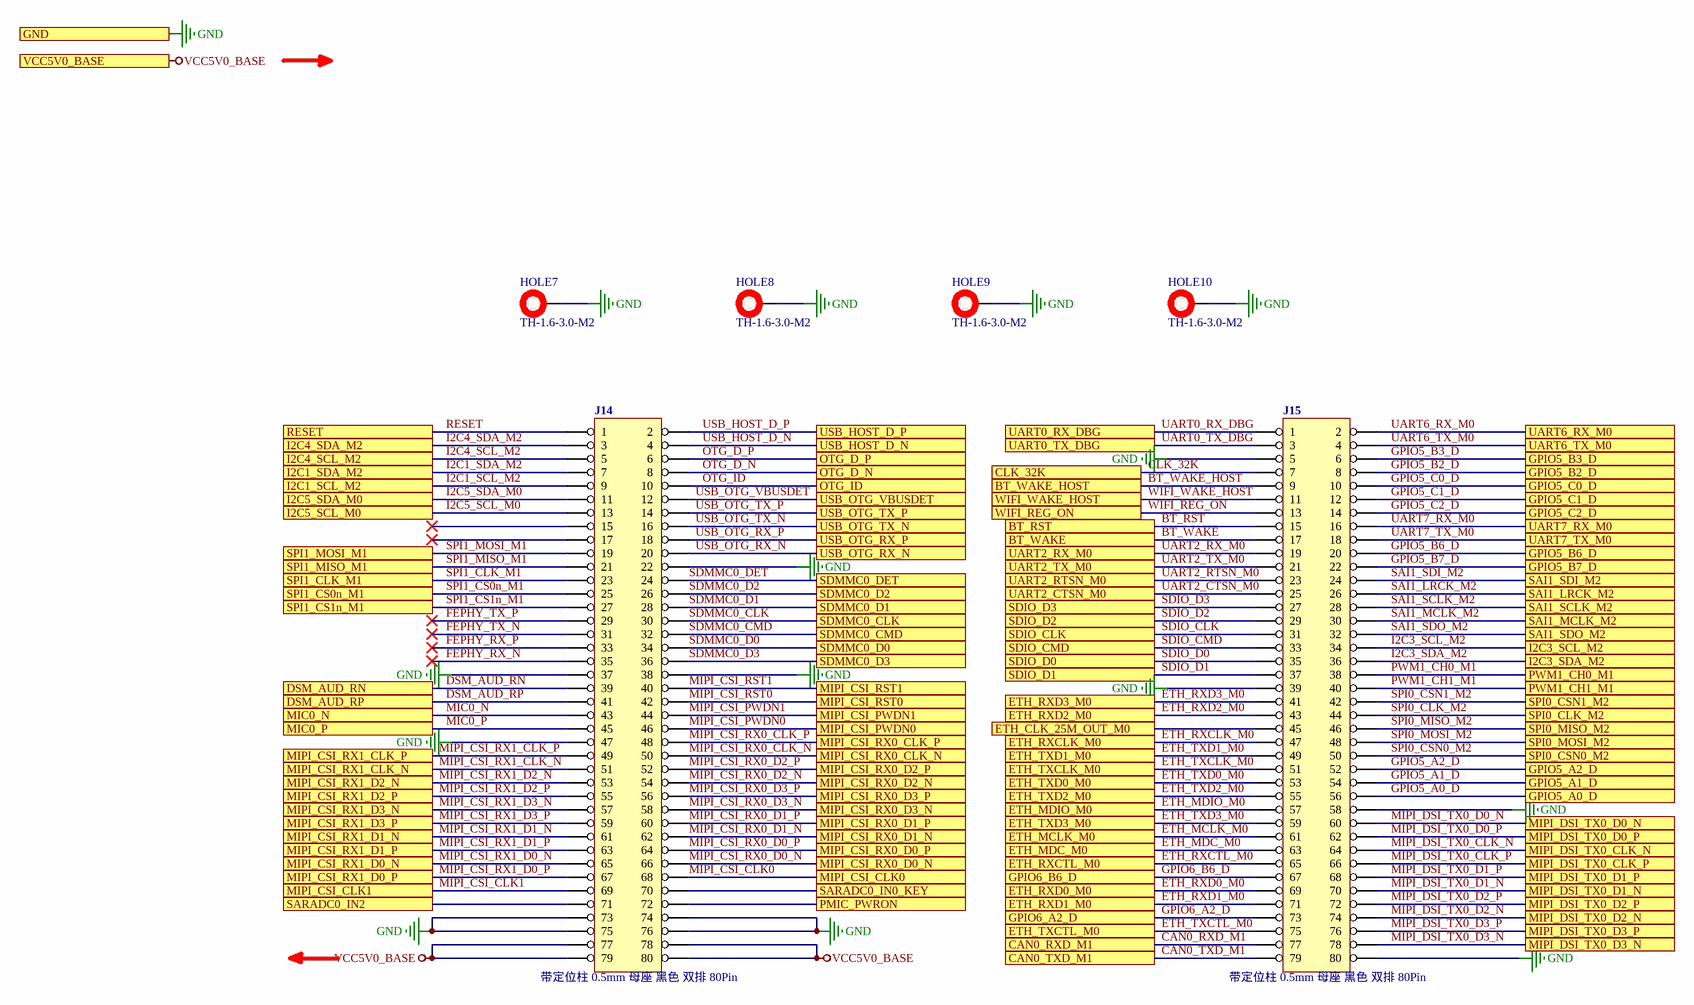
[diagram p3: 04.RV1126B_Core_Board.SchDoc]

### Parts
HOLE7  TH-1.6-3.0-M2  [TH-1.6-3.0-M2]
HOLE8  TH-1.6-3.0-M2  [TH-1.6-3.0-M2]
HOLE9  TH-1.6-3.0-M2  [TH-1.6-3.0-M2]
HOLE10  TH-1.6-3.0-M2  [TH-1.6-3.0-M2]
J14  描述: 带定位柱 0.5mm 母座 黑色 双排 80Pin  [CONN-SMD_80P-P0.50_DF12NA-3.0-80DP-0.5V]  (hidden comment: DF12NA(3.0)-80DP-0.5V(51))
J15  描述: 带定位柱 0.5mm 母座 黑色 双排 80Pin  [CONN-SMD_80P-P0.50_DF12NA-3.0-80DP-0.5V]  (hidden comment: DF12NA(3.0)-80DP-0.5V(51))

### Ports
BT_RST, BT_WAKE, BT_WAKE_HOST, CAN0_RXD_M1, CAN0_TXD_M1, CLK_32K, DSM_AUD_RN, DSM_AUD_RP, ETH_CLK_25M_OUT_M0, ETH_MCLK_M0, ETH_MDC_M0, ETH_MDIO_M0, ETH_RXCLK_M0, ETH_RXCTL_M0, ETH_RXD0_M0, ETH_RXD1_M0, ETH_RXD2_M0, ETH_RXD3_M0, ETH_TXCLK_M0, ETH_TXCTL_M0, ETH_TXD0_M0, ETH_TXD1_M0, ETH_TXD2_M0, ETH_TXD3_M0, GND, GPIO5_A0_D, GPIO5_A1_D, GPIO5_A2_D, GPIO5_B2_D, GPIO5_B3_D, GPIO5_B6_D, GPIO5_B7_D, GPIO5_C0_D, GPIO5_C1_D, GPIO5_C2_D, GPIO6_A2_D, GPIO6_B6_D, I2C1_SCL_M2, I2C1_SDA_M2, I2C3_SCL_M2, I2C3_SDA_M2, I2C4_SCL_M2, I2C4_SDA_M2, I2C5_SCL_M0, I2C5_SDA_M0, MIC0_N, MIC0_P, MIPI_CSI_CLK0, MIPI_CSI_CLK1, MIPI_CSI_PWDN0, MIPI_CSI_PWDN1, MIPI_CSI_RST0, MIPI_CSI_RST1, MIPI_CSI_RX0_CLK_N, MIPI_CSI_RX0_CLK_P, MIPI_CSI_RX0_D0_N, MIPI_CSI_RX0_D0_P, MIPI_CSI_RX0_D1_N, MIPI_CSI_RX0_D1_P, MIPI_CSI_RX0_D2_N, MIPI_CSI_RX0_D2_P, MIPI_CSI_RX0_D3_N, MIPI_CSI_RX0_D3_P, MIPI_CSI_RX1_CLK_N, MIPI_CSI_RX1_CLK_P, MIPI_CSI_RX1_D0_N, MIPI_CSI_RX1_D0_P, MIPI_CSI_RX1_D1_N, MIPI_CSI_RX1_D1_P, MIPI_CSI_RX1_D2_N, MIPI_CSI_RX1_D2_P, MIPI_CSI_RX1_D3_N, MIPI_CSI_RX1_D3_P, MIPI_DSI_TX0_CLK_N, MIPI_DSI_TX0_CLK_P, MIPI_DSI_TX0_D0_N, MIPI_DSI_TX0_D0_P, MIPI_DSI_TX0_D1_N, MIPI_DSI_TX0_D1_P, MIPI_DSI_TX0_D2_N, MIPI_DSI_TX0_D2_P, MIPI_DSI_TX0_D3_N, MIPI_DSI_TX0_D3_P, OTG_D_N, OTG_D_P, OTG_ID, PMIC_PWRON, PWM1_CH0_M1, PWM1_CH1_M1, RESET, SAI1_LRCK_M2, SAI1_MCLK_M2, SAI1_SCLK_M2, SAI1_SDI_M2, SAI1_SDO_M2, SARADC0_IN0_KEY, SARADC0_IN2, SDIO_CLK, SDIO_CMD, SDIO_D0, SDIO_D1, SDIO_D2, SDIO_D3, SDMMC0_CLK, SDMMC0_CMD, SDMMC0_D0, SDMMC0_D1, SDMMC0_D2, SDMMC0_D3, SDMMC0_DET, SPI0_CLK_M2, SPI0_CSN0_M2, SPI0_CSN1_M2, SPI0_MISO_M2, SPI0_MOSI_M2, SPI1_CLK_M1, SPI1_CS0n_M1, SPI1_CS1n_M1, SPI1_MISO_M1, SPI1_MOSI_M1, UART0_RX_DBG, UART0_TX_DBG, UART2_CTSN_M0, UART2_RTSN_M0, UART2_RX_M0, UART2_TX_M0, UART6_RX_M0, UART6_TX_M0, UART7_RX_M0, UART7_TX_M0, USB_HOST_D_N, USB_HOST_D_P, USB_OTG_RX_N, USB_OTG_RX_P, USB_OTG_TX_N, USB_OTG_TX_P, USB_OTG_VBUSDET, VCC5V0_BASE, WIFI_REG_ON, WIFI_WAKE_HOST

### Nets
GND: HOLE7.1 HOLE8.1 HOLE9.1 HOLE10.1 J14.22 J14.37 J14.38 J14.47 J14.73 J14.74 J14.75 J14.76 J15.5 J15.39 J15.58 J15.80 ; port GND  [project net CHIP_GND]
VCC5V0_BASE: J14.77 J14.78 J14.79 J14.80 ; port VCC5V0_BASE
BT_RST: J15.15 ; port BT_RST
BT_WAKE: J15.17 ; port BT_WAKE
BT_WAKE_HOST: J15.9 ; port BT_WAKE_HOST
CAN0_RXD_M1: J15.77 ; port CAN0_RXD_M1
CAN0_TXD_M1: J15.79 ; port CAN0_TXD_M1
CLK_32K: J15.7 ; port CLK_32K
DSM_AUD_RN: J14.39 ; port DSM_AUD_RN
DSM_AUD_RP: J14.41 ; port DSM_AUD_RP
ETH_MCLK_M0: J15.61 ; port ETH_MCLK_M0
ETH_MDC_M0: J15.63 ; port ETH_MDC_M0
ETH_MDIO_M0: J15.57 ; port ETH_MDIO_M0
ETH_RXCLK_M0: J15.47 ; port ETH_RXCLK_M0
ETH_RXCTL_M0: J15.65 ; port ETH_RXCTL_M0
ETH_RXD0_M0: J15.69 ; port ETH_RXD0_M0
ETH_RXD1_M0: J15.71 ; port ETH_RXD1_M0
ETH_RXD2_M0: J15.43 ; port ETH_RXD2_M0
ETH_RXD3_M0: J15.41 ; port ETH_RXD3_M0
ETH_TXCLK_M0: J15.51 ; port ETH_TXCLK_M0
ETH_TXCTL_M0: J15.75 ; port ETH_TXCTL_M0
ETH_TXD0_M0: J15.53 ; port ETH_TXD0_M0
ETH_TXD1_M0: J15.49 ; port ETH_TXD1_M0
ETH_TXD2_M0: J15.55 ; port ETH_TXD2_M0
ETH_TXD3_M0: J15.59 ; port ETH_TXD3_M0
FEPHY_RX_N: J14.35
FEPHY_RX_P: J14.33
FEPHY_TX_N: J14.31
FEPHY_TX_P: J14.29
GPIO5_A0_D: J15.56 ; port GPIO5_A0_D
GPIO5_A1_D: J15.54 ; port GPIO5_A1_D
GPIO5_A2_D: J15.52 ; port GPIO5_A2_D
GPIO5_B2_D: J15.8 ; port GPIO5_B2_D
GPIO5_B3_D: J15.6 ; port GPIO5_B3_D
GPIO5_B6_D: J15.20 ; port GPIO5_B6_D
GPIO5_B7_D: J15.22 ; port GPIO5_B7_D
GPIO5_C0_D: J15.10 ; port GPIO5_C0_D
GPIO5_C1_D: J15.12 ; port GPIO5_C1_D
GPIO5_C2_D: J15.14 ; port GPIO5_C2_D
GPIO6_A2_D: J15.73 ; port GPIO6_A2_D
GPIO6_B6_D: J15.67 ; port GPIO6_B6_D
I2C1_SCL_M2: J14.9 ; port I2C1_SCL_M2
I2C1_SDA_M2: J14.7 ; port I2C1_SDA_M2
I2C3_SCL_M2: J15.34 ; port I2C3_SCL_M2
I2C3_SDA_M2: J15.36 ; port I2C3_SDA_M2
I2C4_SCL_M2: J14.5 ; port I2C4_SCL_M2
I2C4_SDA_M2: J14.3 ; port I2C4_SDA_M2
I2C5_SCL_M0: J14.13 ; port I2C5_SCL_M0
I2C5_SDA_M0: J14.11 ; port I2C5_SDA_M0
MIC0_N: J14.43 ; port MIC0_N
MIC0_P: J14.45 ; port MIC0_P
MIPI_CSI_CLK0: J14.68 ; port MIPI_CSI_CLK0
MIPI_CSI_CLK1: J14.69 ; port MIPI_CSI_CLK1
MIPI_CSI_PWDN0: J14.46 ; port MIPI_CSI_PWDN0
MIPI_CSI_PWDN1: J14.44 ; port MIPI_CSI_PWDN1
MIPI_CSI_RST0: J14.42 ; port MIPI_CSI_RST0
MIPI_CSI_RST1: J14.40 ; port MIPI_CSI_RST1
MIPI_CSI_RX0_CLK_N: J14.50 ; port MIPI_CSI_RX0_CLK_N
MIPI_CSI_RX0_CLK_P: J14.48 ; port MIPI_CSI_RX0_CLK_P
MIPI_CSI_RX0_D0_N: J14.66 ; port MIPI_CSI_RX0_D0_N
MIPI_CSI_RX0_D0_P: J14.64 ; port MIPI_CSI_RX0_D0_P
MIPI_CSI_RX0_D1_N: J14.62 ; port MIPI_CSI_RX0_D1_N
MIPI_CSI_RX0_D1_P: J14.60 ; port MIPI_CSI_RX0_D1_P
MIPI_CSI_RX0_D2_N: J14.54 ; port MIPI_CSI_RX0_D2_N
MIPI_CSI_RX0_D2_P: J14.52 ; port MIPI_CSI_RX0_D2_P
MIPI_CSI_RX0_D3_N: J14.58 ; port MIPI_CSI_RX0_D3_N
MIPI_CSI_RX0_D3_P: J14.56 ; port MIPI_CSI_RX0_D3_P
MIPI_CSI_RX1_CLK_N: J14.51 ; port MIPI_CSI_RX1_CLK_N
MIPI_CSI_RX1_CLK_P: J14.49 ; port MIPI_CSI_RX1_CLK_P
MIPI_CSI_RX1_D0_N: J14.65 ; port MIPI_CSI_RX1_D0_N
MIPI_CSI_RX1_D0_P: J14.67 ; port MIPI_CSI_RX1_D0_P
MIPI_CSI_RX1_D1_N: J14.61 ; port MIPI_CSI_RX1_D1_N
MIPI_CSI_RX1_D1_P: J14.63 ; port MIPI_CSI_RX1_D1_P
MIPI_CSI_RX1_D2_N: J14.53 ; port MIPI_CSI_RX1_D2_N
MIPI_CSI_RX1_D2_P: J14.55 ; port MIPI_CSI_RX1_D2_P
MIPI_CSI_RX1_D3_N: J14.57 ; port MIPI_CSI_RX1_D3_N
MIPI_CSI_RX1_D3_P: J14.59 ; port MIPI_CSI_RX1_D3_P
MIPI_DSI_TX0_CLK_N: J15.64 ; port MIPI_DSI_TX0_CLK_N
MIPI_DSI_TX0_CLK_P: J15.66 ; port MIPI_DSI_TX0_CLK_P
MIPI_DSI_TX0_D0_N: J15.60 ; port MIPI_DSI_TX0_D0_N
MIPI_DSI_TX0_D0_P: J15.62 ; port MIPI_DSI_TX0_D0_P
MIPI_DSI_TX0_D1_N: J15.70 ; port MIPI_DSI_TX0_D1_N
MIPI_DSI_TX0_D1_P: J15.68 ; port MIPI_DSI_TX0_D1_P
MIPI_DSI_TX0_D2_N: J15.74 ; port MIPI_DSI_TX0_D2_N
MIPI_DSI_TX0_D2_P: J15.72 ; port MIPI_DSI_TX0_D2_P
MIPI_DSI_TX0_D3_N: J15.78 ; port MIPI_DSI_TX0_D3_N
MIPI_DSI_TX0_D3_P: J15.76 ; port MIPI_DSI_TX0_D3_P
OTG_D_N: J14.8 ; port OTG_D_N
OTG_D_P: J14.6 ; port OTG_D_P
OTG_ID: J14.10 ; port OTG_ID
PWM1_CH0_M1: J15.38 ; port PWM1_CH0_M1
PWM1_CH1_M1: J15.40 ; port PWM1_CH1_M1
RESET: J14.1 ; port RESET
SAI1_LRCK_M2: J15.26 ; port SAI1_LRCK_M2
SAI1_MCLK_M2: J15.30 ; port SAI1_MCLK_M2
SAI1_SCLK_M2: J15.28 ; port SAI1_SCLK_M2
SAI1_SDI_M2: J15.24 ; port SAI1_SDI_M2
SAI1_SDO_M2: J15.32 ; port SAI1_SDO_M2
SDIO_CLK: J15.31 ; port SDIO_CLK
SDIO_CMD: J15.33 ; port SDIO_CMD
SDIO_D0: J15.35 ; port SDIO_D0
SDIO_D1: J15.37 ; port SDIO_D1
SDIO_D2: J15.29 ; port SDIO_D2
SDIO_D3: J15.27 ; port SDIO_D3
SDMMC0_CLK: J14.30 ; port SDMMC0_CLK
SDMMC0_CMD: J14.32 ; port SDMMC0_CMD
SDMMC0_D0: J14.34 ; port SDMMC0_D0
SDMMC0_D1: J14.28 ; port SDMMC0_D1
SDMMC0_D2: J14.26 ; port SDMMC0_D2
SDMMC0_D3: J14.36 ; port SDMMC0_D3
SDMMC0_DET: J14.24 ; port SDMMC0_DET
SPI0_CLK_M2: J15.44 ; port SPI0_CLK_M2
SPI0_CSN0_M2: J15.50 ; port SPI0_CSN0_M2
SPI0_CSN1_M2: J15.42 ; port SPI0_CSN1_M2
SPI0_MISO_M2: J15.46 ; port SPI0_MISO_M2
SPI0_MOSI_M2: J15.48 ; port SPI0_MOSI_M2
SPI1_CLK_M1: J14.23 ; port SPI1_CLK_M1
SPI1_CS0n_M1: J14.25 ; port SPI1_CS0n_M1
SPI1_CS1n_M1: J14.27 ; port SPI1_CS1n_M1
SPI1_MISO_M1: J14.21 ; port SPI1_MISO_M1
SPI1_MOSI_M1: J14.19 ; port SPI1_MOSI_M1
UART0_RX_DBG: J15.1 ; port UART0_RX_DBG
UART0_TX_DBG: J15.3 ; port UART0_TX_DBG
UART2_CTSN_M0: J15.25 ; port UART2_CTSN_M0
UART2_RTSN_M0: J15.23 ; port UART2_RTSN_M0
UART2_RX_M0: J15.19 ; port UART2_RX_M0
UART2_TX_M0: J15.21 ; port UART2_TX_M0
UART6_RX_M0: J15.2 ; port UART6_RX_M0
UART6_TX_M0: J15.4 ; port UART6_TX_M0
UART7_RX_M0: J15.16 ; port UART7_RX_M0
UART7_TX_M0: J15.18 ; port UART7_TX_M0
USB_HOST_D_N: J14.4 ; port USB_HOST_D_N
USB_HOST_D_P: J14.2 ; port USB_HOST_D_P
USB_OTG_RX_N: J14.20 ; port USB_OTG_RX_N
USB_OTG_RX_P: J14.18 ; port USB_OTG_RX_P
USB_OTG_TX_N: J14.16 ; port USB_OTG_TX_N
USB_OTG_TX_P: J14.14 ; port USB_OTG_TX_P
USB_OTG_VBUSDET: J14.12 ; port USB_OTG_VBUSDET
WIFI_REG_ON: J15.13 ; port WIFI_REG_ON
WIFI_WAKE_HOST: J15.11 ; port WIFI_WAKE_HOST
NetC206_2: J14.72 ; port PMIC_PWRON
NetJ14_70: J14.70 ; port SARADC0_IN0_KEY
NetJ14_71: J14.71 ; port SARADC0_IN2
NetJ15_45: J15.45 ; port ETH_CLK_25M_OUT_M0

Not connected (* = marked no-connect by the designer): J14 15* 17*

### Notes on the sheet
- 产品名称
- 产品型号
- 设计人员
- 设计日期
- 审核人员
- 审核日期
- 图纸名称
- 图纸描述
- 图纸版本
- A3
- 广州灵眸科技有限公司

### Library data of the parts
HOLE7-HOLE10 = 螺柱 TH-1.6-3.0-M2: SPZL000886; 名称: 螺柱; 封装: SMD; 厂商: 雄和远景; 描述: 核心板螺柱 M2.5; 贴片和直插: SMD; SuppliersPartNumber: *; 商品编号: SPZL000886; 工作温度: *; 型号: TH-1.6-3.0-M2
J14 J15 = DF12NA(3.0)-80DP-0.5V(51): SPZL000772; 名称: 板对板连接器; 封装: SMD; 厂商: HRS(广濑); 贴片和直插: SMD; SuppliersPartNumber: *; 型号: DF12NA(3.0)-80DP-0.5V(51); 商品编号: SPZL000772; 工作温度: *

## Sheet 14.Power_DCIN.SchDoc
size A4; CheckedBy: YPC; DocumentNumber: 14; Revision: V1.00; SheetNumber: 14; SheetTotal: 18; SheetName: Power; SheetDescribe: SheetDescribe; Designer: JOW; DesignDate: 2025-04-25; CheckedData: 2025-04-25
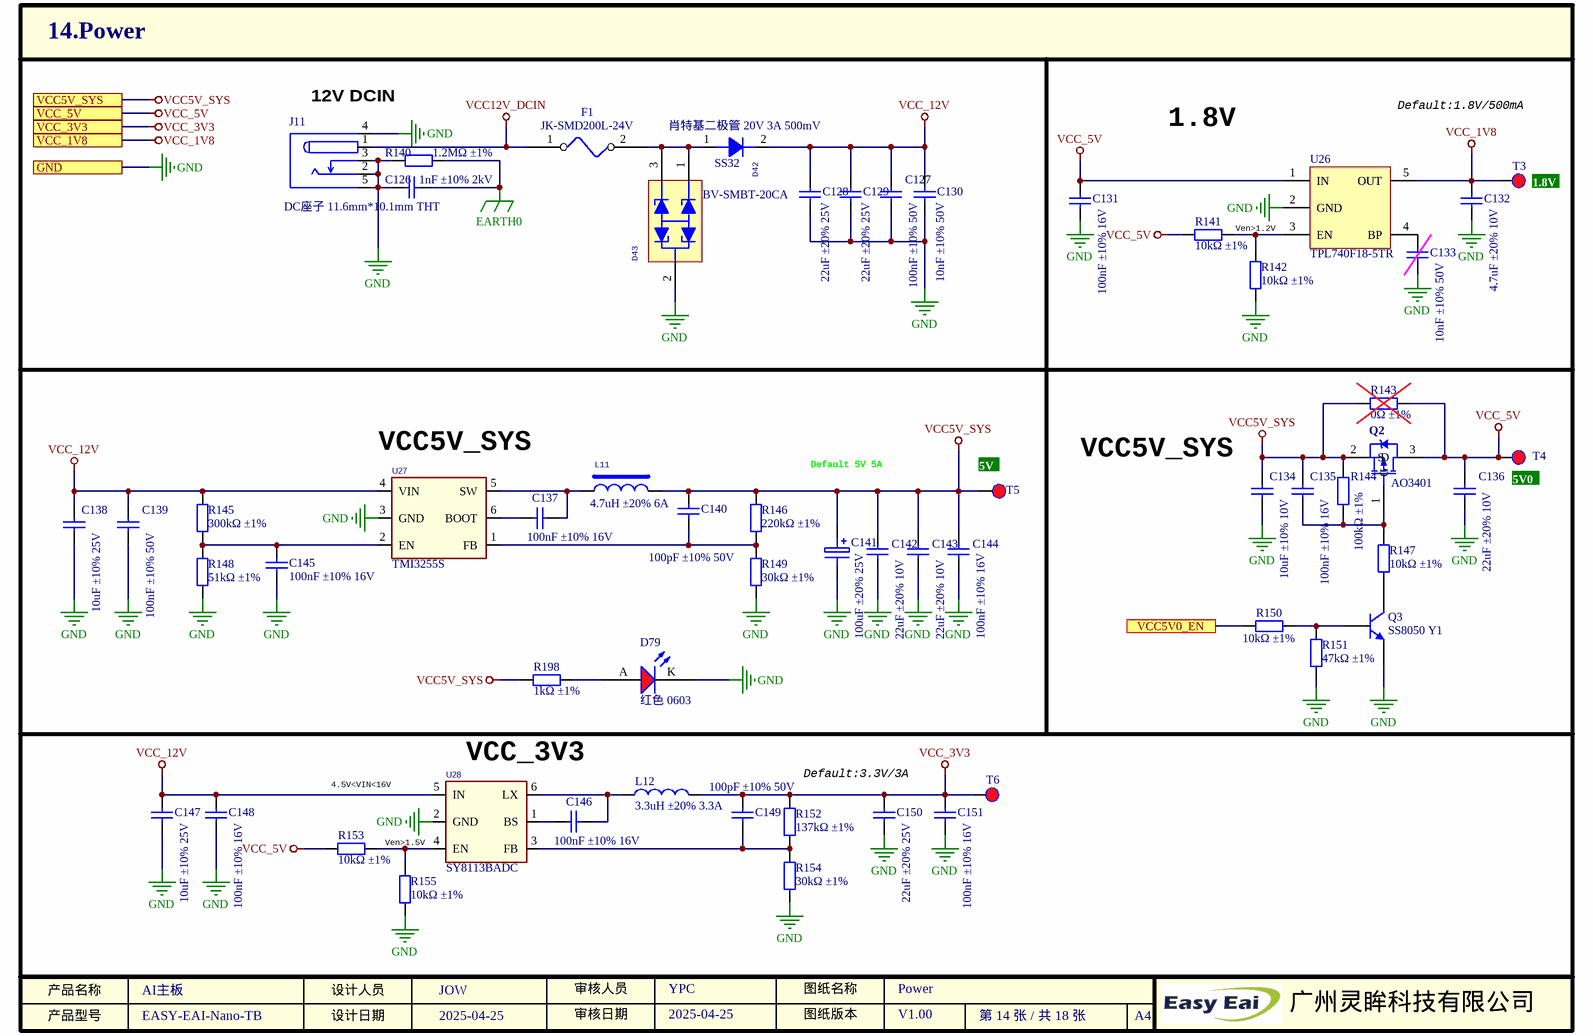
[diagram p4: 14.Power_DCIN.SchDoc]

### Parts
C126  描述: 1nF ±10% 2kV  [1206_C]  (hidden comment: CC1206KKX7RDBB102)
C127  描述: 100nF ±10% 50V  [0603_C]  (hidden comment: CC0603KRX7R9BB104)
C128  描述: 22uF ±20% 25V  [0805_C]  (hidden comment: GRM21BR61E226ME44L)
C129  描述: 22uF ±20% 25V  [0805_C]  (hidden comment: GRM21BR61E226ME44L)
C130  描述: 10nF ±10% 50V  [0402_C]  (hidden comment: CL05B103KB5NNNC)
C131  描述: 100nF ±10% 16V  [0402_C]  (hidden comment: CL05B104KO5NNNC)
C132  描述: 4.7uF ±20% 10V  [0402_C]  (hidden comment: CL05A475MP5NRNC)
C133  描述: 10nF ±10% 50V  [0402_C]  (hidden comment: NC/CL05B103KB5NNNC)  (no BOM)
C134  描述: 10uF ±10% 10V  [0603_C]  (hidden comment: CL10A106KP8NNNC)
C135  描述: 100nF ±10% 16V  [0402_C]  (hidden comment: CL05B104KO5NNNC)
C136  描述: 22uF ±20% 10V  [0603_C]  (hidden comment: CL10A226MP8NUNE)
C137  描述: 100nF ±10% 16V  [0402_C]  (hidden comment: CL05B104KO5NNNC)
C138  描述: 10uF ±10% 25V  [0805_C]  (hidden comment: GRM21BR61E106KA73L)
C139  描述: 100nF ±10% 50V  [0603_C]  (hidden comment: CC0603KRX7R9BB104)
C140  描述: 100pF ±10% 50V  [0402_C]  (hidden comment: CC0402KRX7R9BB101)
C141  描述: 100uF ±20% 25V  [SMD,D6.3xL7.7mm]  (hidden comment: RVT1E101M0607)
C142  描述: 22uF ±20% 10V  [0603_C]  (hidden comment: CL10A226MP8NUNE)
C143  描述: 22uF ±20% 10V  [0603_C]  (hidden comment: CL10A226MP8NUNE)
C144  描述: 100nF ±10% 16V  [0402_C]  (hidden comment: CL05B104KO5NNNC)
C145  描述: 100nF ±10% 16V  [0402_C]  (hidden comment: CL05B104KO5NNNC)
C146  描述: 100nF ±10% 16V  [0402_C]  (hidden comment: CL05B104KO5NNNC)
C147  描述: 10uF ±10% 25V  [0805_C]  (hidden comment: GRM21BR61E106KA73L)
C148  描述: 100nF ±10% 16V  [0402_C]  (hidden comment: CL05B104KO5NNNC)
C149  描述: 100pF ±10% 50V  [0402_C]  (hidden comment: CC0402KRX7R9BB101)
C150  描述: 22uF ±20% 25V  [0805_C]  (hidden comment: GRM21BR61E226ME44L)
C151  描述: 100nF ±10% 16V  [0402_C]  (hidden comment: CL05B104KO5NNNC)
D42  描述: 肖特基二极管 20V 3A 500mV  [DO_214AC]  (hidden comment: 肖特基二极管)
D43  BV-SMBT-20CA  [SMB-T_L5.4-W3.3-BI]
D79  红色 0603  [0603_LED_S1]
F1  JK-SMD200L-24V  [2920]
J11  DC-044A-20A  [DC-044A-20A]  (value not drawn)
L11  MWSA0603S-4R7MT  [IND-SMD_L7.0-W6.6]  (value not drawn)
L12  SMNR4030-3R3MT  [IND-4.0*4.0*3.0]  (value not drawn)
Q2  AO3401  [SOT-23]
Q3  SS8050 Y1  [SOT-23(SOT-23-3)]
R140  描述: 1.2MΩ ±1%  [1206_R]  (hidden comment: 1206W4F1204T5E)
R141  描述: 10kΩ ±1%  [0402_R]  (hidden comment: 0402WGF1002TCE)
R142  描述: 10kΩ ±1%  [0402_R]  (hidden comment: 0402WGF1002TCE)
R143  描述: 0Ω ±1%  [0805_R]  (hidden comment: NC/0805W8F0000T5E)  (no BOM)
R144  描述: 100kΩ ±1%  [0402_R]  (hidden comment: 0402WGF1003TCE)
R145  描述: 300kΩ ±1%  [0402_R]  (hidden comment: 0402WGF3003TCE)
R146  描述: 220kΩ ±1%  [0402_R]  (hidden comment: 0402WGF2203TCE)
R147  描述: 10kΩ ±1%  [0402_R]  (hidden comment: 0402WGF1002TCE)
R148  描述: 51kΩ ±1%  [0402_R]  (hidden comment: 0402WGF5102TCE)
R149  描述: 30kΩ ±1%  [0402_R]  (hidden comment: NQ02WGF3002TCE)
R150  描述: 10kΩ ±1%  [0402_R]  (hidden comment: 0402WGF1002TCE)
R151  描述: 47kΩ ±1%  [0402_R]  (hidden comment: 0402WGF4702TCE)
R152  描述: 137kΩ ±1%  [0402_R]  (hidden comment: 0402WGF1373TCE)
R153  描述: 10kΩ ±1%  [0402_R]  (hidden comment: 0402WGF1002TCE)
R154  描述: 30kΩ ±1%  [0402_R]  (hidden comment: NQ02WGF3002TCE)
R155  描述: 10kΩ ±1%  [0402_R]  (hidden comment: 0402WGF1002TCE)
R198  描述: 1kΩ ±1%  [0402_R]  (hidden comment: 0402WGF1001TCE)
T3  TEST-DOT  [PAD-25/40]  (value not drawn)  (no BOM)
T4  TEST-DOT  [PAD-25/40]  (value not drawn)
T5  TEST-DOT  [PAD-25/40]  (value not drawn)  (no BOM)
T6  TEST-DOT  [PAD-25/40]  (value not drawn)  (no BOM)
U26  TPL740F18-5TR  [SOT-23-5]
U27  TMI3255S  [SOT23-6]
U28  SY8113BADC  [sot23-6]

### Ports
GND, VCC5V0_EN, VCC5V_SYS, VCC_1V8, VCC_3V3, VCC_5V

### Nets
EARTH0: C126.2 R140.2
GND: C126.1 C127.1 C128.1 C129.1 C130.1 C131.1 C132.1 C133.1 C134.1 C136.1 C138.1 C139.1 C141.2 C142.1 C143.1 C144.1 C145.1 C147.1 C148.1 C150.1 C151.1 D43.2 D79.K J11.2 J11.3 J11.4 J11.5 Q3.2(E) R140.1 R142.1 R148.1 R149.1 R151.1 R154.1 R155.1 U26.2(GND) U27.3(GND) U28.2(GND) ; port GND  [project net CHIP_GND]
VCC5V_SYS: C134.2 C135.2 C140.2 C141.1 C142.2 C143.2 C144.2 L11.2 Q2.2(S) R143.1 R144.2 R146.2 R198.1 T5.1 ; port VCC5V_SYS
VCC12V_DCIN: F1.1 J11.1
VCC_1V8: C132.2 T3.1 U26.5(OUT) ; port VCC_1V8
VCC_3V3: C149.2 C150.2 C151.2 L12.2 R152.2 T6.1 ; port VCC_3V3  [project net VCC3V3]
VCC_5V: C131.2 C136.2 Q2.3(D) R141.1 R143.2 R153.1 T4.1 U26.1(IN) ; port VCC_5V
VCC_12V: C127.2 C128.2 C129.2 C130.2 C138.2 C139.2 C147.2 C148.2 D42.2(K) R145.2 U27.4(VIN) U28.5(IN)
NetC133_2: C133.2 U26.4(BP)
NetC135_1: C135.1 Q2.1(G) R144.1 R147.2
NetC137_1: C137.1 U27.6(BOOT)
NetC137_2: C137.2 L11.1 U27.5(SW)
NetC140_1: C140.1 R146.1 R149.2 U27.1(FB)
NetC145_2: C145.2 R145.1 R148.2 U27.2(EN)
NetC146_1: C146.1 U28.1(BS)
NetC146_2: C146.2 L12.1 U28.6(LX)
NetC149_1: C149.1 R152.1 R154.2 U28.3(FB)
NetD42_1: D42.1(A) D43.1 D43.3 F1.2
NetD79_A: D79.A R198.2
NetQ3_1: Q3.1(B) R150.2 R151.2
NetQ3_3: Q3.3(C) R147.1
NetR141_2: R141.2 R142.2 U26.3(EN)
NetR150_1: R150.1 ; port VCC5V0_EN
NetR153_2: R153.2 R155.2 U28.4(EN)

### Notes on the sheet
- (near J11) 12V DCIN
- Default:1.8V/500mA
- 1.8V
- (near R141) Ven>1.2V
- (near T3) 1.8V
- (near U27) VCC5V_SYS
- Default 5V 5A
- (near T5) 5V
- VCC5V_SYS
- (near T4) 5V0
- 4.5V<VIN<16V
- (near U28) VCC_3V3
- Default:3.3V/3A
- Ven>1.5V
- 产品名称
- 产品型号
- 设计人员
- 设计日期
- 审核人员
- 审核日期
- 图纸版本
- 图纸名称
- A4
- 广州灵眸科技有限公司

### Library data of the parts
C126 = 1206 1nF ±10% 2kV: as C1 on sheet 03.Main; 型号: CC1206KKX7RDBB102; SuppliersPartNumber: C23631; 商品编号: SPZL000332
C127 C139 = 0603 100nF ±10% 50V: SPZL000386; 名称: 贴片电容; 厂商: YAGEO(国巨); 封装: 0603; 工作温度: -55~125℃; 贴片和直插: SMD; 型号: CC0603KRX7R9BB104; SuppliersPartNumber: C14663; 商品编号: SPZL000386
C128 C129 C150 = 0805 22uF ±20% 25V: SPZL000267; 名称: 贴片电容; 厂商: muRata(村田); 封装: 0805; 工作温度: -55~85℃; 贴片和直插: SMD; 型号: GRM21BR61E226ME44L; SuppliersPartNumber: C86816; 商品编号: SPZL000267
C130 C133 = 0402 10nF ±10% 50V: SPZL000342; 名称: 贴片电容; 厂商: SAMSUNG(三星); 封装: 0402; 工作温度: -55~125℃; 贴片和直插: SMD; 型号: CL05B103KB5NNNC; SuppliersPartNumber: C15195; 商品编号: SPZL000342
C131 C135 C137 C144-C146 C148 C151 = 0402 100nF ±10% 16V: SPZL000259; 名称: 贴片电容; 厂商: SAMSUNG(三星); 封装: 0402; 工作温度: -55~125℃; 贴片和直插: SMD; 型号: CL05B104KO5NNNC; SuppliersPartNumber: C1525; 商品编号: SPZL000259
C132 = 0402 4.7uF ±20% 10V: SPZL000339; 名称: 贴片电容; 厂商: SAMSUNG(三星); 封装: 0402; 工作温度: -55~85℃; 贴片和直插: SMD; 型号: CL05A475MP5NRNC; SuppliersPartNumber: C23733; 商品编号: SPZL000339
C134 = 0603 10uF ±10% 10V: SPZL000260; 名称: 贴片电容; 厂商: SAMSUNG(三星); 封装: 0603; 工作温度: -55~85℃; 贴片和直插: SMD; 型号: CL10A106KP8NNNC; SuppliersPartNumber: C19702; 商品编号: SPZL000260
C136 C142 C143 = 0603 22uF ±20% 10V: SPZL000315; 名称: 贴片电容; 厂商: SAMSUNG(三星); 封装: 0603; 工作温度: -55~85℃; 贴片和直插: SMD; 型号: CL10A226MP8NUNE; SuppliersPartNumber: C86295; 商品编号: SPZL000315
C138 C147 = 0805 10uF ±10% 25V: SPZL000262; 名称: 贴片电容; 厂商: muRata(村田); 封装: 0805; 工作温度: -55~85℃; 贴片和直插: SMD; 型号: GRM21BR61E106KA73L; SuppliersPartNumber: C84416; 商品编号: SPZL000262
C140 C149 = 0402 100pF ±10% 50V: SPZL000312; 名称: 贴片电容; 厂商: YAGEO(国巨); 封装: 0402; 工作温度: -55~125℃; 贴片和直插: SMD; 型号: CC0402KRX7R9BB101; SuppliersPartNumber: C281751; 商品编号: SPZL000312
C141 = 电解电容 100uF ±20% 25V: SPZL000519; 名称: 电解电容; 厂商: ROQANG(容强); 贴片和直插: SMD; 工作温度: -45~105℃; SuppliersPartNumber: C72477; 封装: SMD,D6.3xL7.7mm; 型号: RVT1E101M0607; 商品编号: SPZL000519
D42 = SS32: SPZL000094; 名称: 二极管; 厂商: MDD; 贴片和直插: SMD; 封装: SMA(DO-214AC); 工作温度: -55~125℃; SuppliersPartNumber: C34897; 商品编号: SPZL000094; 型号: SS32
D43 = TVS BV-SMBT-20CA: SPZL000611; 名称: TVS; 封装: SMB-T; 贴片和直插: SMD; 厂商: Bencent(槟城); 描述: Cj=2500pF; 工作温度: -40~125℃; 商品编号: SPZL000611; 型号: BV-SMBT-20CA
D79 = 红色 0603: SPZL000214; 厂商: EVERLIGHT(台湾亿光); 封装: 0603; 贴片和直插: SMD; 型号: 19-217/R6C-AL1M2VY/3T; 名称: LED; 工作温度: -40~85℃; SuppliersPartNumber: C72044; 商品编号: SPZL000214; 描述: 红色 0603
F1 = 自恢复保险丝 JK-SMD200L-24V: SPZL000105; 厂商: JK(金科); 名称: 自恢复保险丝; 贴片和直插: SMD; 描述: 2A/24V; 工作温度: -40~85℃; 封装: 2920; SuppliersPartNumber: C692154; 商品编号: SPZL000105; 型号: JK-SMD200L-24V
J11 = DC座子 11.6mm*10.1mm THT: SPZL000133; 封装: THT; 厂商: 韩国韩荣; 名称: 电源插座; 工作温度: -20~70℃; 贴片和直插: THT; SuppliersPartNumber: C129006; 型号: DC-044A-20A; 商品编号: SPZL000133; 描述: DC座子 11.6mm*10.1mm THT
L11 = 4.7uH ±20% 6A: SPZL001133; 厂商: Sunlord(顺络); 贴片和直插: SMD; 名称: 电感; 封装: SMD,7x6.6mm; 工作温度: -40~125℃; SuppliersPartNumber: C408447; 型号: MWSA0603S-4R7MT; 商品编号: SPZL001133; 描述: 4.7uH ±20% 6A
L12 = 3.3uH ±20% 3.3A: SPZL000206; 名称: 电感; 封装: 4.0*4.0*3.0mm; 贴片和直插: SMD; 厂商: SXN(顺翔诺); 工作温度: -40~125℃; SuppliersPartNumber: C135269; 型号: SMNR4030-3R3MT; 商品编号: SPZL000206; 描述: 3.3uH ±20% 3.3A
Q2 = P沟道 AO3401: SPZL000800; 名称: MOS管; 厂商: TWGMC(台湾迪嘉); 贴片和直插: SMD; 描述: P沟道 30V 4.2A; 工作温度: -40~105℃; 封装: SOT-23; SuppliersPartNumber: C727156; 商品编号: SPZL000800; 型号: AO3401
Q3 = NPN SS8050 Y1: SPZL000089; 封装: SOT-23; 厂商: CJ（江苏长电/长晶）; 名称: 三极管; 贴片和直插: SMD; 描述: NPN 25V 1.5A; 工作温度: -55~150℃; SuppliersPartNumber: C2150; 商品编号: SPZL000089; 型号: SS8050 Y1
R140 = 1206 1.2MΩ ±1%: as R1 on sheet 03.Main; SuppliersPartNumber: C22107; 型号: 1206W4F1204T5E; 商品编号: SPZL000388
R141 R142 R147 R150 R153 R155 = 0402 10kΩ ±1%: SPZL000271; 封装: 0402; 厂商: UNI-ROYAL(厚声); 贴片和直插: SMD; 名称: 电阻; 工作温度: -55~155℃; SuppliersPartNumber: C25744; 型号: 0402WGF1002TCE; 商品编号: SPZL000271
R143 = 0805 0Ω ±1%: SPZL000350; 封装: 0805; 厂商: UNI-ROYAL(厚声); 名称: 电阻; 贴片和直插: SMD; 工作温度: -55~155℃; SuppliersPartNumber: C17477; 型号: 0805W8F0000T5E; 商品编号: SPZL000350
R144 = 0402 100kΩ ±1%: SPZL000282; 封装: 0402; 厂商: UNI-ROYAL(厚声); 贴片和直插: SMD; 名称: 电阻; 工作温度: -55~155℃; SuppliersPartNumber: C25741; 型号: 0402WGF1003TCE; 商品编号: SPZL000282
R145 = 0402 300kΩ ±1%: SPZL000393; 封装: 0402; 厂商: UNI-ROYAL(厚声); 贴片和直插: SMD; 名称: 电阻; 工作温度: -55~155℃; SuppliersPartNumber: C25774; 型号: 0402WGF3003TCE; 商品编号: SPZL000393
R146 = 0402 220kΩ ±1%: SPZL000877; 封装: 0402; 厂商: UNI-ROYAL(厚声); 贴片和直插: SMD; 名称: 电阻; 工作温度: -55~125℃; SuppliersPartNumber: C25767; 型号: 0402WGF2203TCE; 商品编号: SPZL000877
R148 = 0402 51kΩ ±1%: SPZL000788; 封装: 0402; 厂商: UNI-ROYAL(厚声); 贴片和直插: SMD; 名称: 电阻; 工作温度: -55~155℃; SuppliersPartNumber: C25794; 型号: 0402WGF5102TCE; 商品编号: SPZL000788
R149 R154 = 0402 30kΩ ±1%: SPZL000323; 封装: 0402; 厂商: UNI-ROYAL(厚声); 贴片和直插: SMD; 名称: 电阻; 工作温度: -55~155℃; SuppliersPartNumber: C965267; 型号: NQ02WGF3002TCE; 商品编号: SPZL000323
R151 = 0402 47kΩ ±1%: SPZL000348; 封装: 0402; 厂商: UNI-ROYAL(厚声); 贴片和直插: SMD; 名称: 电阻; 工作温度: -55~155℃; SuppliersPartNumber: C25792; 型号: 0402WGF4702TCE; 商品编号: SPZL000348
R152 = 0402 137kΩ ±1%: SPZL000322; 封装: 0402; 厂商: UNI-ROYAL(厚声); 贴片和直插: SMD; 名称: 电阻; 工作温度: -55~155℃; SuppliersPartNumber: C32298; 型号: 0402WGF1373TCE; 商品编号: SPZL000322
R198 = 0402 1kΩ ±1%: SPZL000275; 封装: 0402; 厂商: UNI-ROYAL(厚声); 贴片和直插: SMD; 名称: 电阻; 工作温度: -55~125℃; SuppliersPartNumber: C11702; 型号: 0402WGF1001TCE; 商品编号: SPZL000275
U26 = TPL740F18-5TR: SPZL000630; 名称: 电源IC; 厂商: 3PEAK; 贴片和直插: SMD; 描述: LDO; 工作温度: -40~85℃; 封装: SOT-23-5; SuppliersPartNumber: *; 商品编号: SPZL000630; 型号: TPL740F18-5TR
U27 = TMI3255S: SPZL001130; 厂商: Toll(拓尔微); 贴片和直插: SMD; 名称: 电源IC; 描述: DC-DC; 工作温度: -40℃~125℃; 封装: SOT23-6; 商品编号: SPZL001130; 型号: TMI3255S
U28 = SY8113BADC: SPZL000041; 厂商: silergy(矽力杰); 封装: TSOT-23-6; 贴片和直插: SMD; 名称: 电源IC; 描述: DC-DC; 工作温度: -40~85℃; SuppliersPartNumber: C78989; 商品编号: SPZL000041; 型号: SY8113BADC